# EAGLE design LAB-DEB429 (EAGLE 6.6.0)
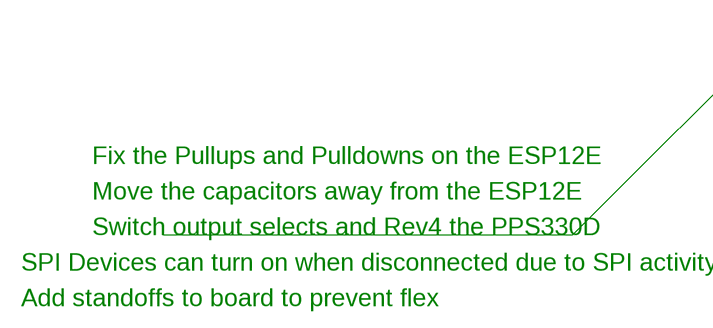
[diagram p0: schematic, sheet 1, part 1 of 2]
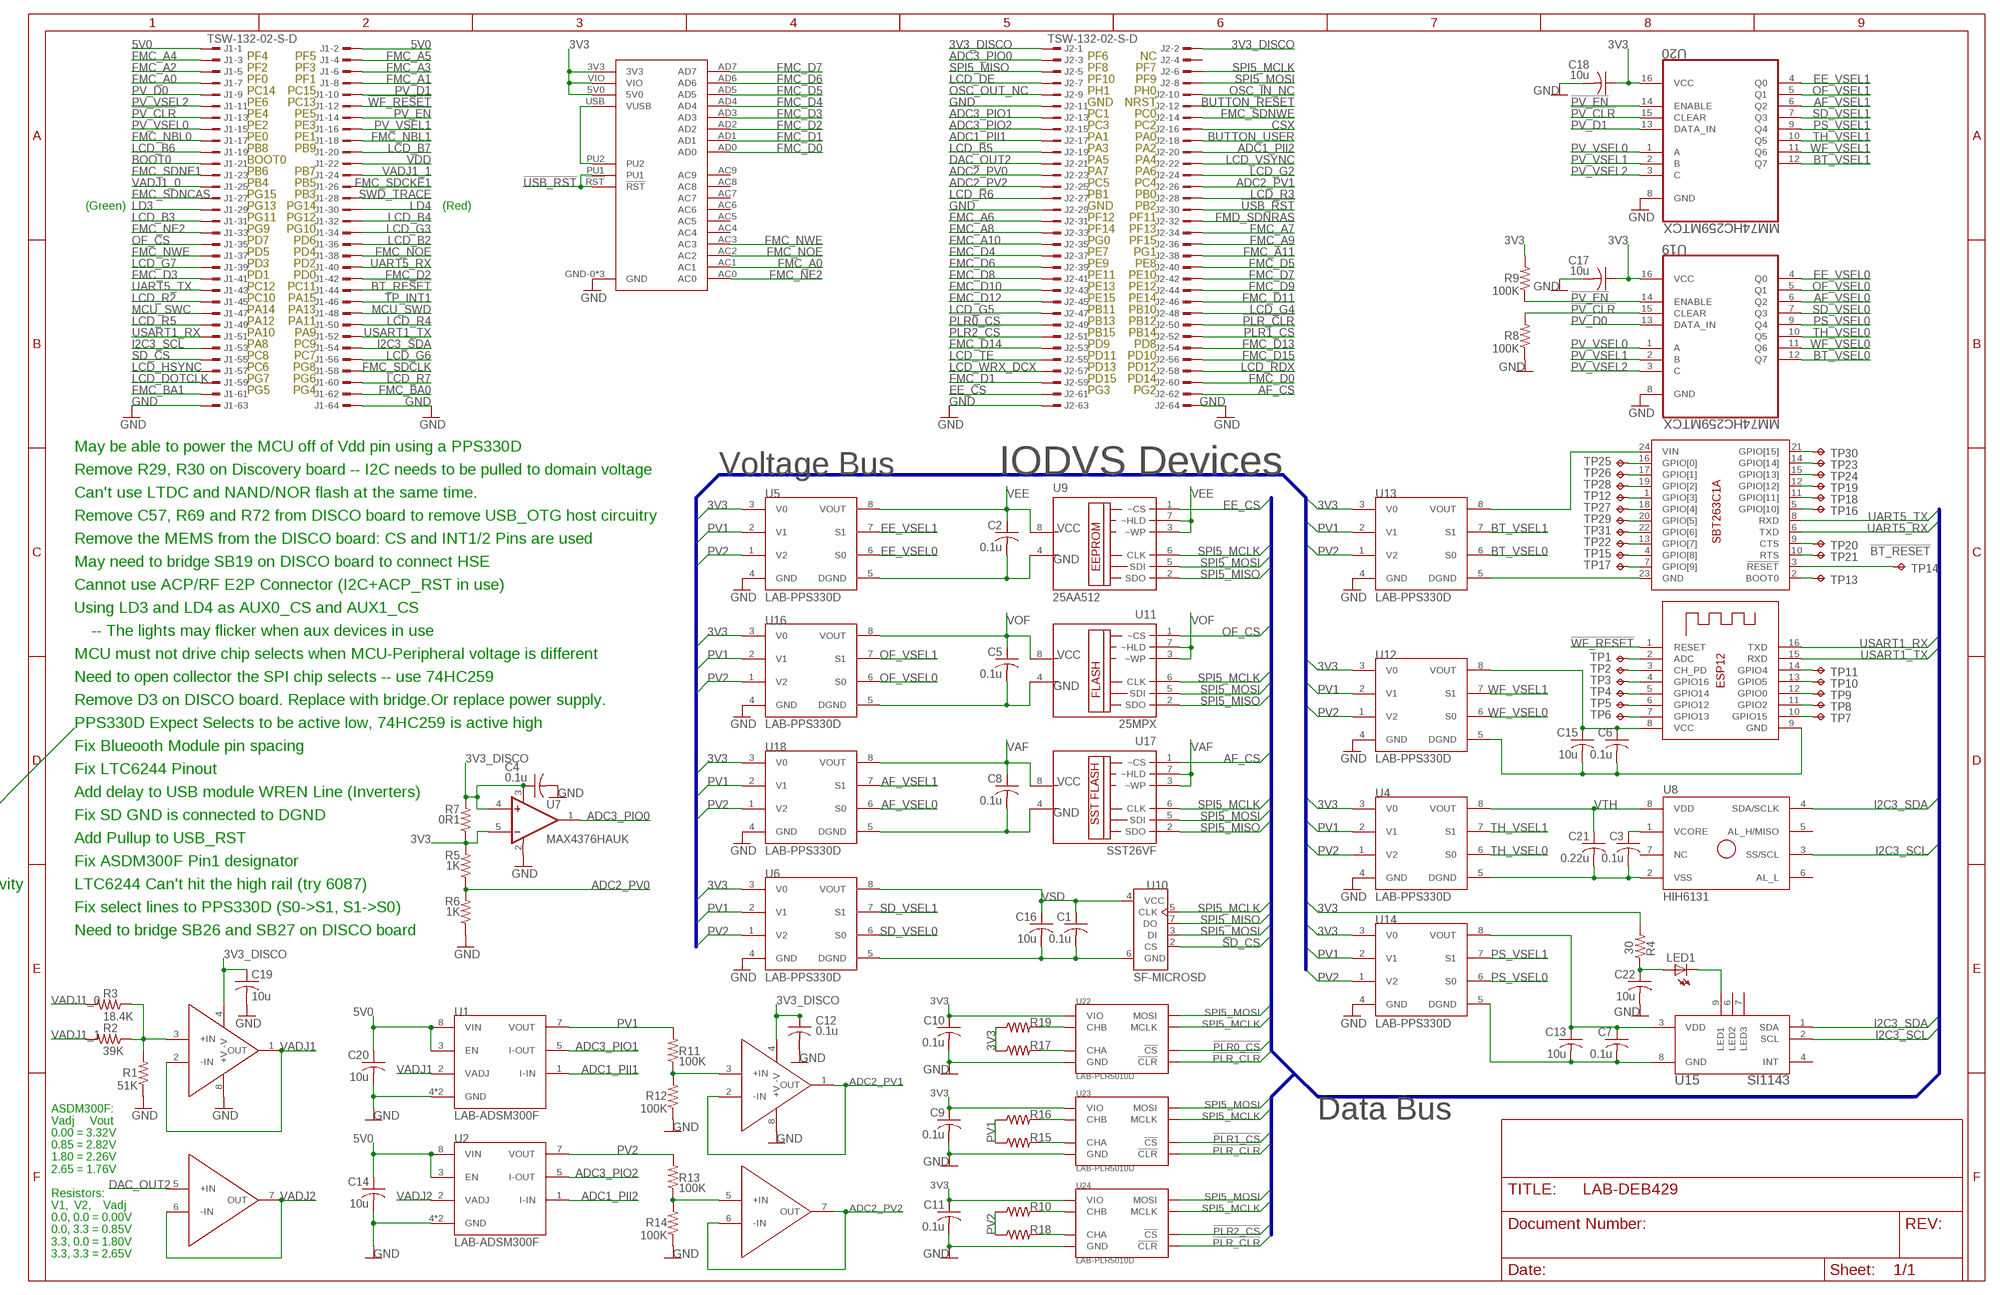
[diagram p1: schematic, sheet 1, part 2 of 2]

## Parts
C1  0.1u  C-USC0603  [C0603]
C2  0.1u  C-USC0603  [C0603]
C3  0.1u  C-USC0603  [C0603]
C4  0.1u  C-USC0603  [C0603]
C5  0.1u  C-USC0603  [C0603]
C6  0.1u  C-USC0603  [C0603]
C7  0.1u  C-USC0603  [C0603]
C8  0.1u  C-USC0603  [C0603]
C9  0.1u  C-USC0603  [C0603]
C10  0.1u  C-USC0603  [C0603]
C11  0.1u  C-USC0603  [C0603]
C12  0.1u  C-USC0603  [C0603]
C13  10u  C-USC0603  [C0603]
C14  10u  C-USC0603  [C0603]
C15  10u  C-USC0603  [C0603]
C16  10u  C-USC0603  [C0603]
C17  10u  C-USC0603  [C0603]
C18  10u  C-USC0603  [C0603]
C19  10u  C-USC0603  [C0603]
C20  10u  C-USC0603  [C0603]
C21  0.22u  C-USC0603  [C0603]
C22  10u  C-USC0603  [C0603]
J1  TSW-132-02-S-D  [TSW-132-02-S-D]
J2  TSW-132-02-S-D  [TSW-132-02-S-D]
LED1  LEDCHIPLED_1206  [CHIPLED_1206]
R1  51K  R-US_R0603  [R0603]
R2  39K  R-US_R0603  [R0603]
R3  18.4K  R-US_R0603  [R0603]
R4  30  R-US_R0603  [R0603]
R5  1K  R-US_R0603  [R0603]
R6  1K  R-US_R0603  [R0603]
R7  0R1  R-US_R0603  [R0603]
R8  100K  R-US_R0603  [R0603]
R9  100K  R-US_R0603  [R0603]
R10  R-US_0204/7  [0204/7]
R11  100K  R-US_R0603  [R0603]
R12  100K  R-US_R0603  [R0603]
R13  100K  R-US_R0603  [R0603]
R14  100K  R-US_R0603  [R0603]
R15  R-US_0204/7  [0204/7]
R16  R-US_0204/7  [0204/7]
R17  R-US_0204/7  [0204/7]
R18  R-US_0204/7  [0204/7]
R19  R-US_0204/7  [0204/7]
TP1  TPPAD1-13  [P1-13]
TP2  TPPAD1-13  [P1-13]
TP3  TPPAD1-13  [P1-13]
TP4  TPPAD1-13  [P1-13]
TP5  TPPAD1-13  [P1-13]
TP6  TPPAD1-13  [P1-13]
TP7  TPPAD1-13  [P1-13]
TP8  TPPAD1-13  [P1-13]
TP9  TPPAD1-13  [P1-13]
TP10  TPPAD1-13  [P1-13]
TP11  TPPAD1-13  [P1-13]
TP12  TPPAD1-13  [P1-13]
TP13  TPPAD1-13  [P1-13]
TP14  TPPAD1-13  [P1-13]
TP15  TPPAD1-13  [P1-13]
TP16  TPPAD1-13  [P1-13]
TP17  TPPAD1-13  [P1-13]
TP18  TPPAD1-13  [P1-13]
TP19  TPPAD1-13  [P1-13]
TP20  TPPAD1-13  [P1-13]
TP21  TPPAD1-13  [P1-13]
TP22  TPPAD1-13  [P1-13]
TP23  TPPAD1-13  [P1-13]
TP24  TPPAD1-13  [P1-13]
TP25  TPPAD1-13  [P1-13]
TP26  TPPAD1-13  [P1-13]
TP27  TPPAD1-13  [P1-13]
TP28  TPPAD1-13  [P1-13]
TP29  TPPAD1-13  [P1-13]
TP30  TPPAD1-13  [P1-13]
TP31  TPPAD1-13  [P1-13]
U1  LAB-ADSM300F  [LAB-ASDM300F]
U2  LAB-ADSM300F  [LAB-ASDM300F]
U3  LTC6244  [MSOP8]
U4  LAB-PPS330D  [LAB-PPS330D]
U5  LAB-PPS330D  [LAB-PPS330D]
U6  LAB-PPS330D  [LAB-PPS330D]
U7  MAX4376HAUK  MAX4376  [SOT23-5]
U8  HIH6131  [SO-08M]
U9  25AA512  [SO-08M]
U10  SF-MICROSD  [MICROSD]
U11  25MPX  [SO-08M]
U12  LAB-PPS330D  [LAB-PPS330D]
U13  LAB-PPS330D  [LAB-PPS330D]
U14  LAB-PPS330D  [LAB-PPS330D]
U15  SI1143  [QFN10]
U16  LAB-PPS330D  [LAB-PPS330D]
U17  SST26VF  [SO-08M]
U18  LAB-PPS330D  [LAB-PPS330D]
U19  MM74HC259MTCX  [SOP65P640X90-16N]
U20  MM74HC259MTCX  [SOP65P640X90-16N]
U21  LTC6244  [MSOP8]
U22  LAB-PLR5010D  [LAB-PLR5010D]
U23  LAB-PLR5010D  [LAB-PLR5010D]
U24  LAB-PLR5010D  [LAB-PLR5010D]
U25  ESP-12  [ESP-12]
U26  SPBT2632C1A  [SPBT2632C1A]
U27  UM232H  [UM232H]

## Nets
3V3: C9.1 C10.1 C11.1 C17.1 C18.1 R4.2 R5.2 R7.1 R9.2 R17.1 R19.1 U4.3(V0) U5.3(V0) U6.3(V0) U7.5(-IN) U12.3(V0) U13.3(V0) U14.3(V0) U16.3(V0) U18.3(V0) U19.16(VCC) U20.16(VCC) U22.VDD(VIO) U23.VDD(VIO) U24.VDD(VIO) U27.3V3 U27.5V0 U27.VIO
3V3_DISCO: C4.1 C12.1 C19.1 J2.1 J2.2 R7.2 U3.4(-V) U7.3(V+) U7.4(+IN) U21.4(-V)
5V0: C14.1 C20.1 J1.1 J1.2 U1.3(EN) U1.8(VIN) U2.3(EN) U2.8(VIN)
!BT_RESET: J1.44 TP14.TP U26.3(!RESET)
!PLR0_CS: J2.49 U22.!CLR(!CS)
!PLR1_CS: J2.52 U23.!CLR(!CS)
!PLR2_CS: J2.51 U24.!CLR(!CS)
!PLR_CLR: J2.50 U22.!CS(!CLR) U23.!CS(!CLR) U24.!CS(!CLR)
!PV_CLR: J1.13 R8.2 U19.15(CLEAR) U20.15(CLEAR)
!PV_EN: J1.14 R9.1 U19.14(ENABLE) U20.14(ENABLE)
!USB_RST: J2.30 U27.!RST U27.PU1
!WF_RESET: J1.12 U25.1(RESET)
ADC1_PII1: J2.17 U1.1(I-IN)
ADC1_PII2: J2.20 U2.1(I-IN)
ADC2_PV0: J2.23 R5.1 R6.2
ADC2_PV1: J2.26 U21.1(OUT) U21.2(-IN)
ADC2_PV2: J2.25 U21.6(-IN) U21.7(OUT)
ADC3_PIO0: J2.3 U7.1(OUT)
ADC3_PIO1: J2.13 U1.5(I-OUT)
ADC3_PIO2: J2.15 U2.5(I-OUT)
AF_CS: J2.62 U17.1(~CS)
AF_VSEL0: U18.6(S0) U19.6(Q2)
AF_VSEL1: U18.7(S1) U20.6(Q2)
BOOT0: J1.21
BT_VSEL0: U13.6(S0) U19.12(Q7)
BT_VSEL1: U13.7(S1) U20.12(Q7)
BUTTON_RESET: J2.12
BUTTON_USER: J2.18
CSX: J2.16
DAC_OUT2: J2.21 U3.5(+IN)
EE_CS: J2.61 U9.1(~CS)
EE_VSEL0: U5.6(S0) U19.4(Q0)
EE_VSEL1: U5.7(S1) U20.4(Q0)
FMC_A0: J1.7 U27.AC1
FMC_A1: J1.8
FMC_A2: J1.5
FMC_A3: J1.6
FMC_A4: J1.3
FMC_A5: J1.4
FMC_A6: J2.31
FMC_A7: J2.34
FMC_A8: J2.33
FMC_A9: J2.36
FMC_A10: J2.35
FMC_A11: J2.38
FMC_BA0: J1.62
FMC_BA1: J1.61
FMC_D0: J2.60 U27.AD0
FMC_D1: J2.59 U27.AD1
FMC_D2: J1.42 U27.AD2
FMC_D3: J1.41 U27.AD3
FMC_D4: J2.37 U27.AD4
FMC_D5: J2.40 U27.AD5
FMC_D6: J2.39 U27.AD6
FMC_D7: J2.42 U27.AD7
FMC_D8: J2.41
FMC_D9: J2.44
FMC_D10: J2.43
FMC_D11: J2.46
FMC_D12: J2.45
FMC_D13: J2.54
FMC_D14: J2.53
FMC_D15: J2.56
FMC_NBL0: J1.17
FMC_NBL1: J1.18
FMC_NE2: J1.33 U27.AC0
FMC_NOE: J1.38 U27.AC2
FMC_NWE: J1.37 U27.AC3
FMC_SDCKE1: J1.26
FMC_SDCLK: J1.58
FMC_SDNCAS: J1.27
FMC_SDNE1: J1.23
FMC_SDNWE: J2.14
FMD_SDNRAS: J2.32
GND: C1.2 C4.2 C9.2 C10.2 C11.2 C12.2 C14.2 C16.2 C17.2 C18.2 C19.2 C20.2 C22.2 J1.63 J1.64 J2.11 J2.29 J2.63 J2.64 R1.1 R6.1 R8.1 R12.1 R14.1 U1.4(GND) U1.6(GND) U2.4(GND) U2.6(GND) U3.8(+V) U4.4(GND) U5.4(GND) U6.4(GND) U6.5(DGND) U7.2(V-) U10.6(GND) U12.4(GND) U13.4(GND) U14.4(GND) U16.4(GND) U18.4(GND) U19.8(GND) U20.8(GND) U21.8(+V) U22.CHA(GND) U23.CHA(GND) U24.CHA(GND) U27.GND-0(GND) U27.GND-1(GND) U27.SLD(GND)
I2C3_SCL: J1.53 U8.3(SS/SCL) U15.2(SCL)
I2C3_SDA: J1.54 U8.4(SDA/SCLK) U15.1(SDA)
LCD_B2: J1.36
LCD_B3: J1.31
LCD_B4: J1.32
LCD_B5: J2.19
LCD_B6: J1.19
LCD_B7: J1.20
LCD_DE: J2.7
LCD_DOTCLK: J1.59
LCD_G2: J2.24
LCD_G3: J1.34
LCD_G4: J2.48
LCD_G5: J2.47
LCD_G6: J1.56
LCD_G7: J1.39
LCD_HSYNC: J1.57
LCD_R2: J1.45
LCD_R3: J2.28
LCD_R4: J1.50
LCD_R5: J1.49
LCD_R6: J2.27
LCD_R7: J1.60
LCD_RDX: J2.58
LCD_TE: J2.55
LCD_VSYNC: J2.22
LCD_WRX_DCX: J2.57
LD3: J1.29
LD4: J1.30
MCU_SWC: J1.47
MCU_SWD: J1.48
N$1: C6.1 C15.1 U12.8(VOUT) U25.8(VCC)
N$2: C2.2 U5.5(DGND) U9.4(GND)
N$3: C22.1 LED1.A R4.1
N$4: TP12.TP U26.1(GPIO[3])
N$5: U13.5(DGND) U26.23(GND)
N$6: TP10.TP U25.13(GPIO5)
N$7: TP7.TP U25.10(GPIO15)
N$8: TP13.TP U26.2(BOOT0)
N$9: TP8.TP U25.11(GPIO2)
N$10: TP9.TP U25.12(GPIO0)
N$11: TP11.TP U25.14(GPIO4)
N$12: TP1.TP U25.2(ADC)
N$13: TP2.TP U25.3(CH_PD)
N$14: TP3.TP U25.4(GPIO16)
N$15: TP4.TP U25.5(GPIO14)
N$16: TP5.TP U25.6(GPIO12)
N$17: TP6.TP U25.7(GPIO13)
N$18: TP15.TP U26.4(GPIO[8])
N$19: TP16.TP U26.5(GPIO[10])
N$20: LED1.C U15.9(LED1)
N$21: TP17.TP U26.7(GPIO[9])
N$22: C6.2 C15.2 U12.5(DGND) U25.9(GND)
N$23: TP18.TP U26.11(GPIO[11])
N$24: C5.2 U11.4(GND) U16.5(DGND)
N$25: U27.PU2 U27.USB(VUSB)
N$26: U13.8(VOUT) U26.24(VIN)
N$27: C3.1 U8.1(VCORE)
N$28: TP19.TP U26.12(GPIO[12])
N$29: TP22.TP U26.13(GPIO[7])
N$30: TP23.TP U26.14(GPIO[14])
N$31: C8.2 U17.4(GND) U18.5(DGND)
N$32: TP24.TP U26.15(GPIO[13])
N$33: TP25.TP U26.16(GPIO[0])
N$34: TP26.TP U26.17(GPIO[1])
N$35: TP27.TP U26.18(GPIO[4])
N$36: TP28.TP U26.19(GPIO[2])
N$37: TP29.TP U26.20(GPIO[5])
N$38: C7.2 C13.2 U14.5(DGND) U15.8(GND)
N$39: C3.2 C21.2 U4.5(DGND) U8.2(VSS)
N$40: C7.1 C13.1 U14.8(VOUT) U15.3(VDD)
N$41: TP30.TP U26.21(GPIO[15])
N$42: TP31.TP U26.22(GPIO[6])
N$51: TP20.TP U26.9(CTS)
N$52: TP21.TP U26.10(RTS)
N$176: R17.2 U22.CHB(CHA)
N$177: R19.2 U22.MCLK(CHB)
N$178: R16.2 U23.MCLK(CHB)
N$179: R15.2 U23.CHB(CHA)
N$180: R10.2 U24.MCLK(CHB)
N$181: R18.2 U24.CHB(CHA)
N$182: R13.1 R14.2 U21.5(+IN)
N$183: R11.1 R12.2 U21.3(+IN)
OF_CS: J1.35 U11.1(~CS)
OF_VSEL0: U16.6(S0) U19.5(Q1)
OF_VSEL1: U16.7(S1) U20.5(Q1)
OSC_IN_NC: J2.10
OSC_OUT_NC: J2.9
PS_VSEL0: U14.6(S0) U19.9(Q4)
PS_VSEL1: U14.7(S1) U20.9(Q4)
PV1: R11.2 R15.1 R16.1 U1.7(VOUT) U4.2(V1) U5.2(V1) U6.2(V1) U12.2(V1) U13.2(V1) U14.2(V1) U16.2(V1) U18.2(V1)
PV2: R10.1 R13.2 R18.1 U2.7(VOUT) U4.1(V2) U5.1(V2) U6.1(V2) U12.1(V2) U13.1(V2) U14.1(V2) U16.1(V2) U18.1(V2)
PV_D0: J1.9 U19.13(DATA_IN)
PV_D1: J1.10 U20.13(DATA_IN)
PV_VSEL0: J1.15 U19.1(A) U20.1(A)
PV_VSEL1: J1.16 U19.2(B) U20.2(B)
PV_VSEL2: J1.11 U19.3(C) U20.3(C)
SD_CS: J1.55 U10.2(CS)
SD_VSEL0: U6.6(S0) U19.7(Q3)
SD_VSEL1: U6.7(S1) U20.7(Q3)
SPI5_MCLK: J2.6 U9.6(CLK) U10.5(CLK) U11.6(CLK) U17.6(CLK) U22.GND(MCLK) U23.GND(MCLK) U24.GND(MCLK)
SPI5_MISO: J2.5 U9.2(SDO) U10.7(DO) U11.2(SDO) U17.2(SDO)
SPI5_MOSI: J2.8 U9.5(SDI) U10.3(DI) U11.5(SDI) U17.5(SDI) U22.MOSI U23.MOSI U24.MOSI
SWD_TRACE: J1.28
TH_VSEL0: U4.6(S0) U19.10(Q5)
TH_VSEL1: U4.7(S1) U20.10(Q5)
TP_INT1: J1.46
UART5_RX: J1.40 U26.6(TXD)
UART5_TX: J1.43 U26.8(RXD)
USART1_RX: J1.51 U25.16(TXD)
USART1_TX: J1.52 U25.15(RXD)
VADJ1: U1.2(VADJ) U3.1(OUT) U3.2(-IN)
VADJ1_0: J1.25 R3.2
VADJ1_1: J1.24 R2.2
VADJ2: U2.2(VADJ) U3.6(-IN) U3.7(OUT)
VADJIN: R1.2 R2.1 R3.1 U3.3(+IN)
VAF: C8.1 U17.3(~WP) U17.7(~HLD) U17.8(VCC) U18.8(VOUT)
VDD: J1.22
VEE: C2.1 U5.8(VOUT) U9.3(~WP) U9.7(~HLD) U9.8(VCC)
VOF: C5.1 U11.3(~WP) U11.7(~HLD) U11.8(VCC) U16.8(VOUT)
VSD: C1.1 C16.1 U6.8(VOUT) U10.4(VCC)
VTH: C21.1 U4.8(VOUT) U8.8(VDD)
WF_VSEL0: U12.6(S0) U19.11(Q6)
WF_VSEL1: U12.7(S1) U20.11(Q6)
Unconnected: J2.4 U8.5(AL_H/MISO) U8.6(AL_L) U8.7(NC) U15.4(INT) U15.6(LED2) U15.7(LED3) U27.AC4 U27.AC5 U27.AC6 U27.AC7 U27.AC8 U27.AC9

## Buses
SPI5_MCLK,SPI5_MOSI,SPI5_MISO,EE_CS,OF_CS,AF_CS,SD_CS,!PLR0_CS,!PLR1_CS,!PLR2_CS,I2C3_SDA,I2C3_SCL,USART1_TX,USART1_RX,UART5_TX,UART5_RX,!PLR_CLR
+3.3V,PV1,PV2

## Notes on the sheet
- PF4 | PF5 | PF6 | NC
- PF2 | PF3 | PF8 | PF7
- PF0 | PF1 | PF10 | PF9
- PC14 | PC15 | PH1 | PH0
- PE6 | PC13 | GND | NRST
- PE4 | PE5 | PC1 | PC0
- PE2 | PE3 | PC3 | PC2
- PE0 | PE1 | PA1 | PA0
- PB8 | PB9 | PA3 | PA2
- BOOT0 | PA5 | PA4
- PB6 | PB7 | PA7 | PA6
- PB4 | PB5 | PC5 | PC4
- PG15 | PB3 | PB1 | PB0
- (Green) | PG13 | PG14 | (Red) | GND | PB2
- PG11 | PG12 | PF12 | PF11
- PG9 | PG10 | PF14 | PF13
- PD7 | PD6 | PG0 | PF15
- PD5 | PD4 | PE7 | PG1
- PD3 | PD2 | PE9 | PE8
- PD1 | PD0 | PE11 | PE10
- PC12 | PC11 | PE13 | PE12
- PC10 | PA15 | PE15 | PE14
- PA14 | PA13 | PB11 | PB10
- PA12 | PA11 | PB13 | PB12
- PA10 | PA9 | PB15 | PB14
- PA8 | PC9 | PD9 | PD8
- PC8 | PC7 | PD11 | PD10
- PC6 | PG8 | PD13 | PD12
- PG7 | PG6 | PD15 | PD14
- PG5 | PG4 | PG3 | PG2
- May be able to power the MCU off of Vdd pin using a PPS330D
- Remove R29, R30 on Discovery board -- I2C needs to be pulled to domain voltage | Voltage Bus | IODVS Devices
- Can't use LTDC and NAND/NOR flash at the same time.
- Remove C57, R69 and R72 from DISCO board to remove USB_OTG host circuitry
- Remove the MEMS from the DISCO board: CS and INT1/2 Pins are used
- May need to bridge SB19 on DISCO board to connect HSE
- Cannot use ACP/RF E2P Connector (I2C+ACP_RST in use)
- Using LD3 and LD4 as AUX0_CS and AUX1_CS
- -- The lights may flicker when aux devices in use
- MCU must not drive chip selects when MCU-Peripheral voltage is different
- Need to open collector the SPI chip selects -- use 74HC259
- Remove D3 on DISCO board. Replace with bridge.Or replace power supply.
- PPS330D Expect Selects to be active low, 74HC259 is active high
- Fix Blueooth Module pin spacing
- Fix LTC6244 Pinout
- Add delay to USB module WREN Line (Inverters)
- Fix the Pullups and Pulldowns on the ESP12E | Fix SD GND is connected to DGND
- Move the capacitors away from the ESP12E | Add Pullup to USB_RST
- Switch output selects and Rev4 the PPS330D | Fix ASDM300F Pin1 designator
- SPI Devices can turn on when disconnected due to SPI activity | LTC6244 Can't hit the high rail (try 6087)
- Add standoffs to board to prevent flex | Fix select lines to PPS330D (S0->S1, S1->S0)
- Need to bridge SB26 and SB27 on DISCO board
- Data Bus
- ASDM300F:
  Vadj     Vout
  0.00 = 3.32V
  0.85 = 2.82V
  1.80 = 2.26V
  2.65 = 1.76V
  
  Resistors:
  V1,  V2,    Vadj
  0.0, 0.0 = 0.00V
  0.0, 3.3 = 0.85V
  3.3, 0.0 = 1.80V
  3.3, 3.3 = 2.65V

## Library data of the parts
C1-C22 = rcl:C-US: CAPACITOR, American symbol
J1 J2 = con-samtec:TSW-132-02-S-D: THROUGH-HOLE .025" SQ POST HEADER Source: Samtec TSW.pdf; OC_FARNELL: unknown; OC_NEWARK: unknown
LED1 = adafruit:LED: LED OSRAM: - CHIPLED LG R971, LG N971, LY N971, LG Q971, LY Q971, LO R971, LY R971 LH N974, LH R974 LS Q976, LO Q976, LY Q976 LO Q996 - Hyper CHIPLED LW Q18S LB Q993, LB Q99A, LB R99A - SideLED LS A670, LO A670, LY A670, LG A670, LP A670 LB A673, LV A673, LT A673, LW A673 LH A674 LY A675 LS A676, LA A676, LO A676, LY A676, LW A676 LS A679, LY A679, LG A679 - Hyper Micro SIDELED® LS Y876, LA Y876, LO Y876, LY Y876 LT Y87S - SmartLED LW L88C, LW L88S LB L89C, LB L89S, LG L890 LS L89K, LO L89K, LY L89K LS L896, LA L896, LO L896, LY L896 - TOPLED LS T670, LO T670, LY T670, LG T670, LP T670 LSG T670, LSP T670, LSY T670, LOP T670, LYG T670 LG T671, LOG T671, LSG T671 LB T673, LV T673, LT T673, LW T673 LH T674 LS T676, LA T676, LO T676, LY T676, LB T676, LH T676, LSB T676, LW T676 LB T67C, LV T67C, LT T67C, LS T67K, LO T67K, LY T67K, LW E67C LS E67B, LA E67B, LO E67B, LY E67B, LB E67C, LV E67C, LT E67C LW T67C LS T679, LY T679, LG T679 LS T770, LO T770, LY T770, LG T770, LP T770 LB T773, LV T773, LT T773, LW T773 LH T774 LS E675, LA E675, LY E675, LS T675 LS T776, LA T776, LO T776, LY T776, LB T776 LHGB T686 LT T68C, LB T68C - Hyper Mini TOPLED® LB M676 - Mini TOPLED Santana® LG M470 LS M47K, LO M47K, LY M47K Source: http://www.osram.convergy.de/
R1-R19 = rcl:R-US_: RESISTOR, American symbol
TP1-TP31 = testpad:TP: Test pad
U1 U2 = LAB304:LAB-ADSM300F
U3 U21 = SparkFun-AnalogIC:LTC6244: Low-noise, high-speed rail-to-rail CMOS op-amp
U4-U6 U12-U14 U16 U18 = LAB304:LAB-PPS330D
U7 = PEGMA:MAX4376
U8 = PEGMA:HIH6131
U9 = PEGMA:25AA512
U10 = PEGMA:SF-MICROSD
U11 = PEGMA:25MPX
U15 = My Library-adm:SI1143
U17 = LAB304:SST26VF
U19 U20 = Fairchild_By_element14_Batch_1:MM74HC259MTCX: 8-Bit Addressable Latch/3-to-8 Line Decoder; MPN: MM74HC259MTCX; OC_FARNELL: 1607831; OC_NEWARK: 58K1947; PACKAGE: TSSOP-16; SUPPLIER: FAIRCHILD SEMICONDUCTOR
U22-U24 = LAB304:LAB-PLR5010D
U25 = adafruit:ESP-12
U26 = LAB304:SPBT2632C1A
U27 = LAB304:UM232H

## Board
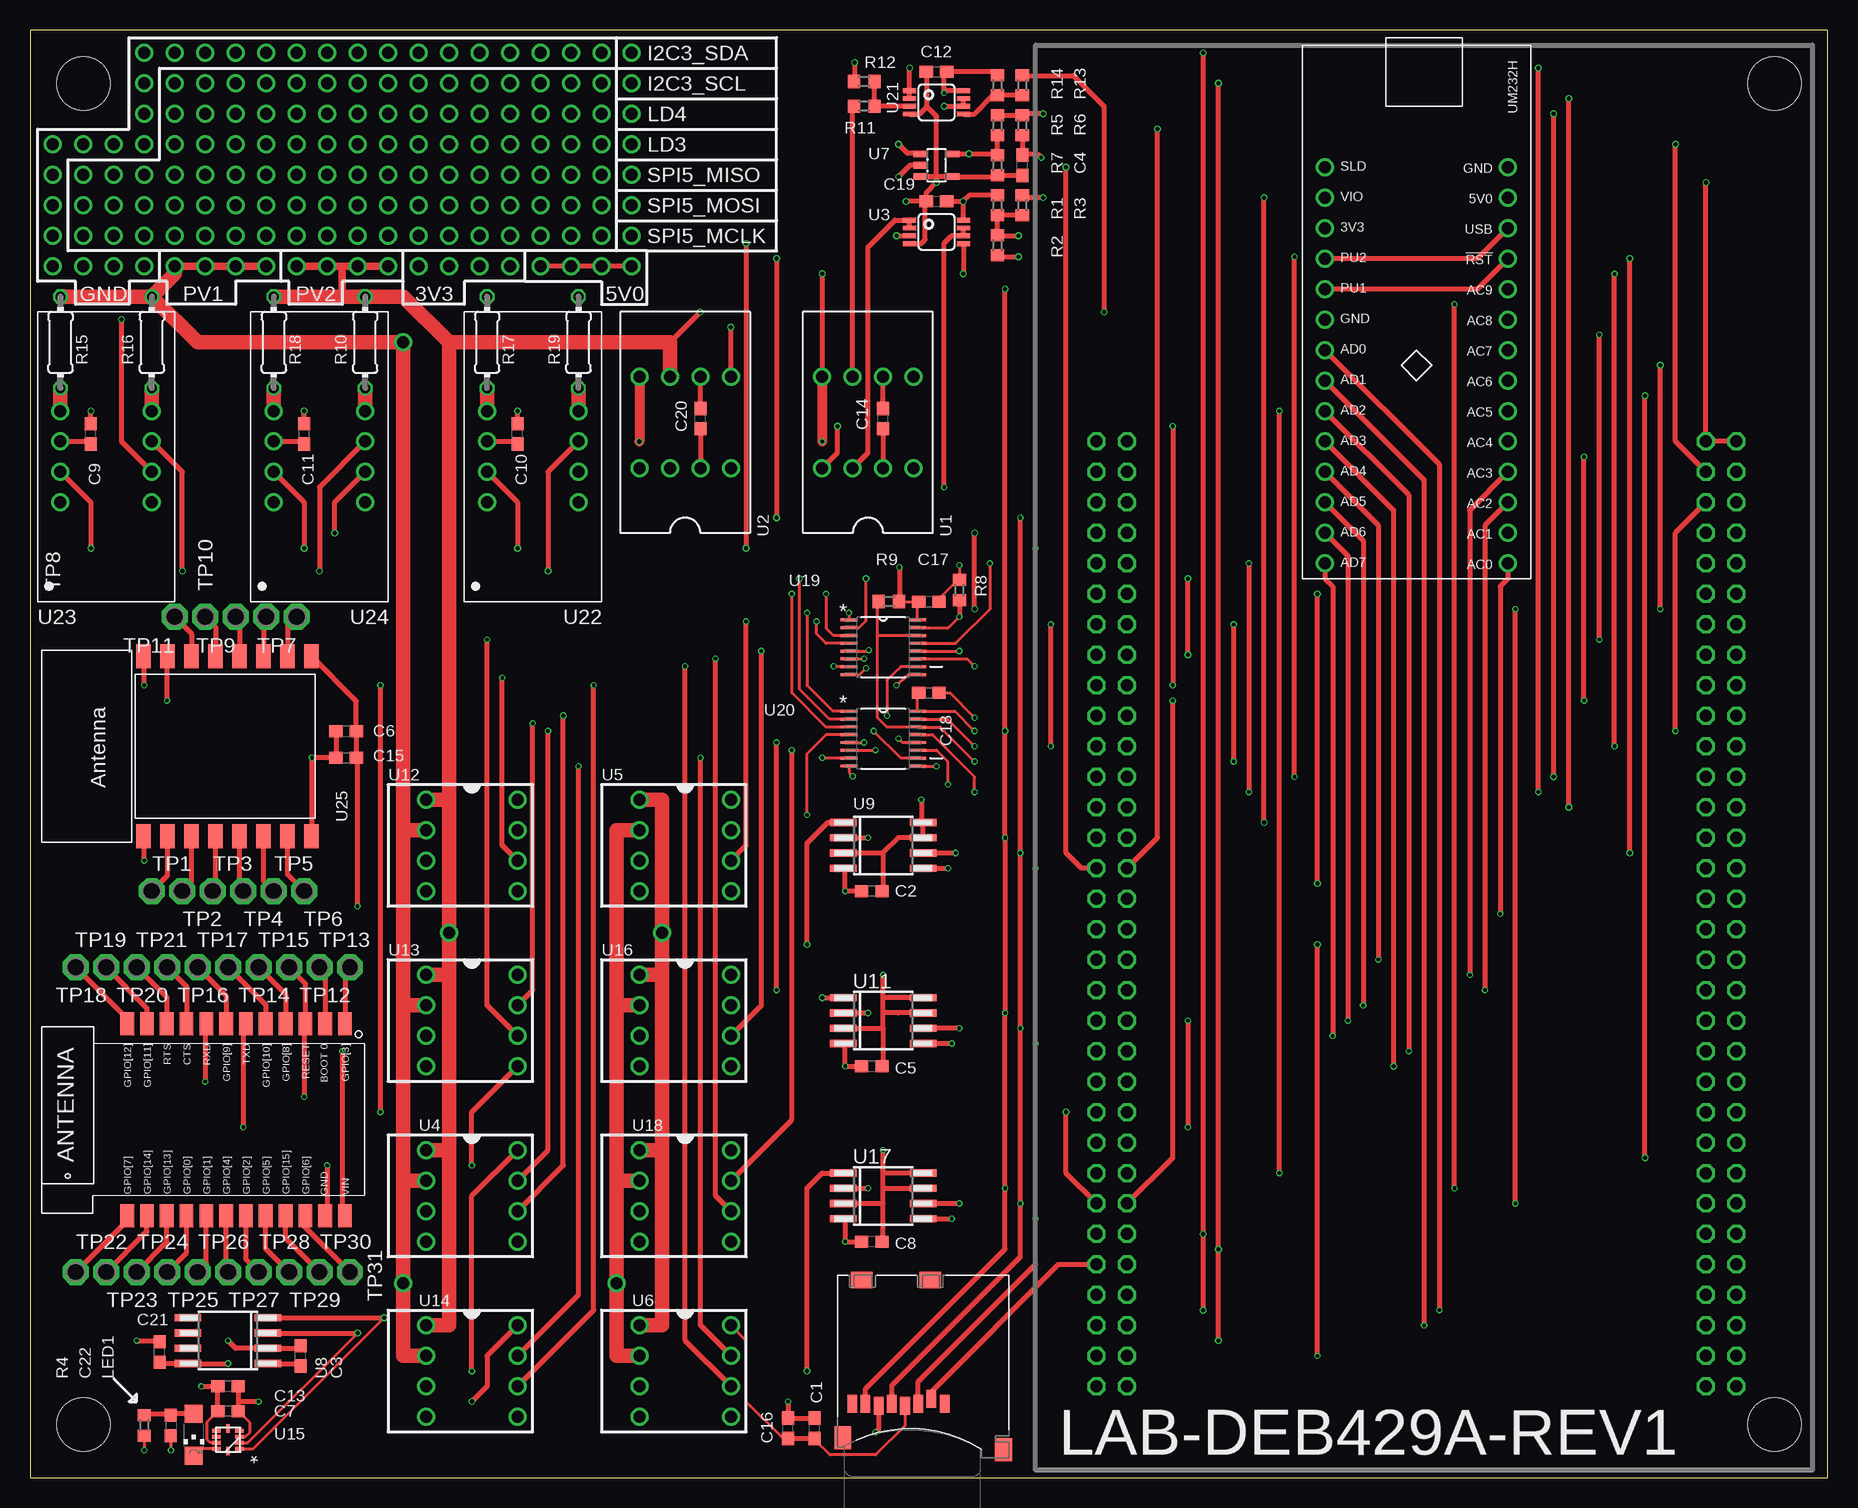
[diagram p2: board, top side]
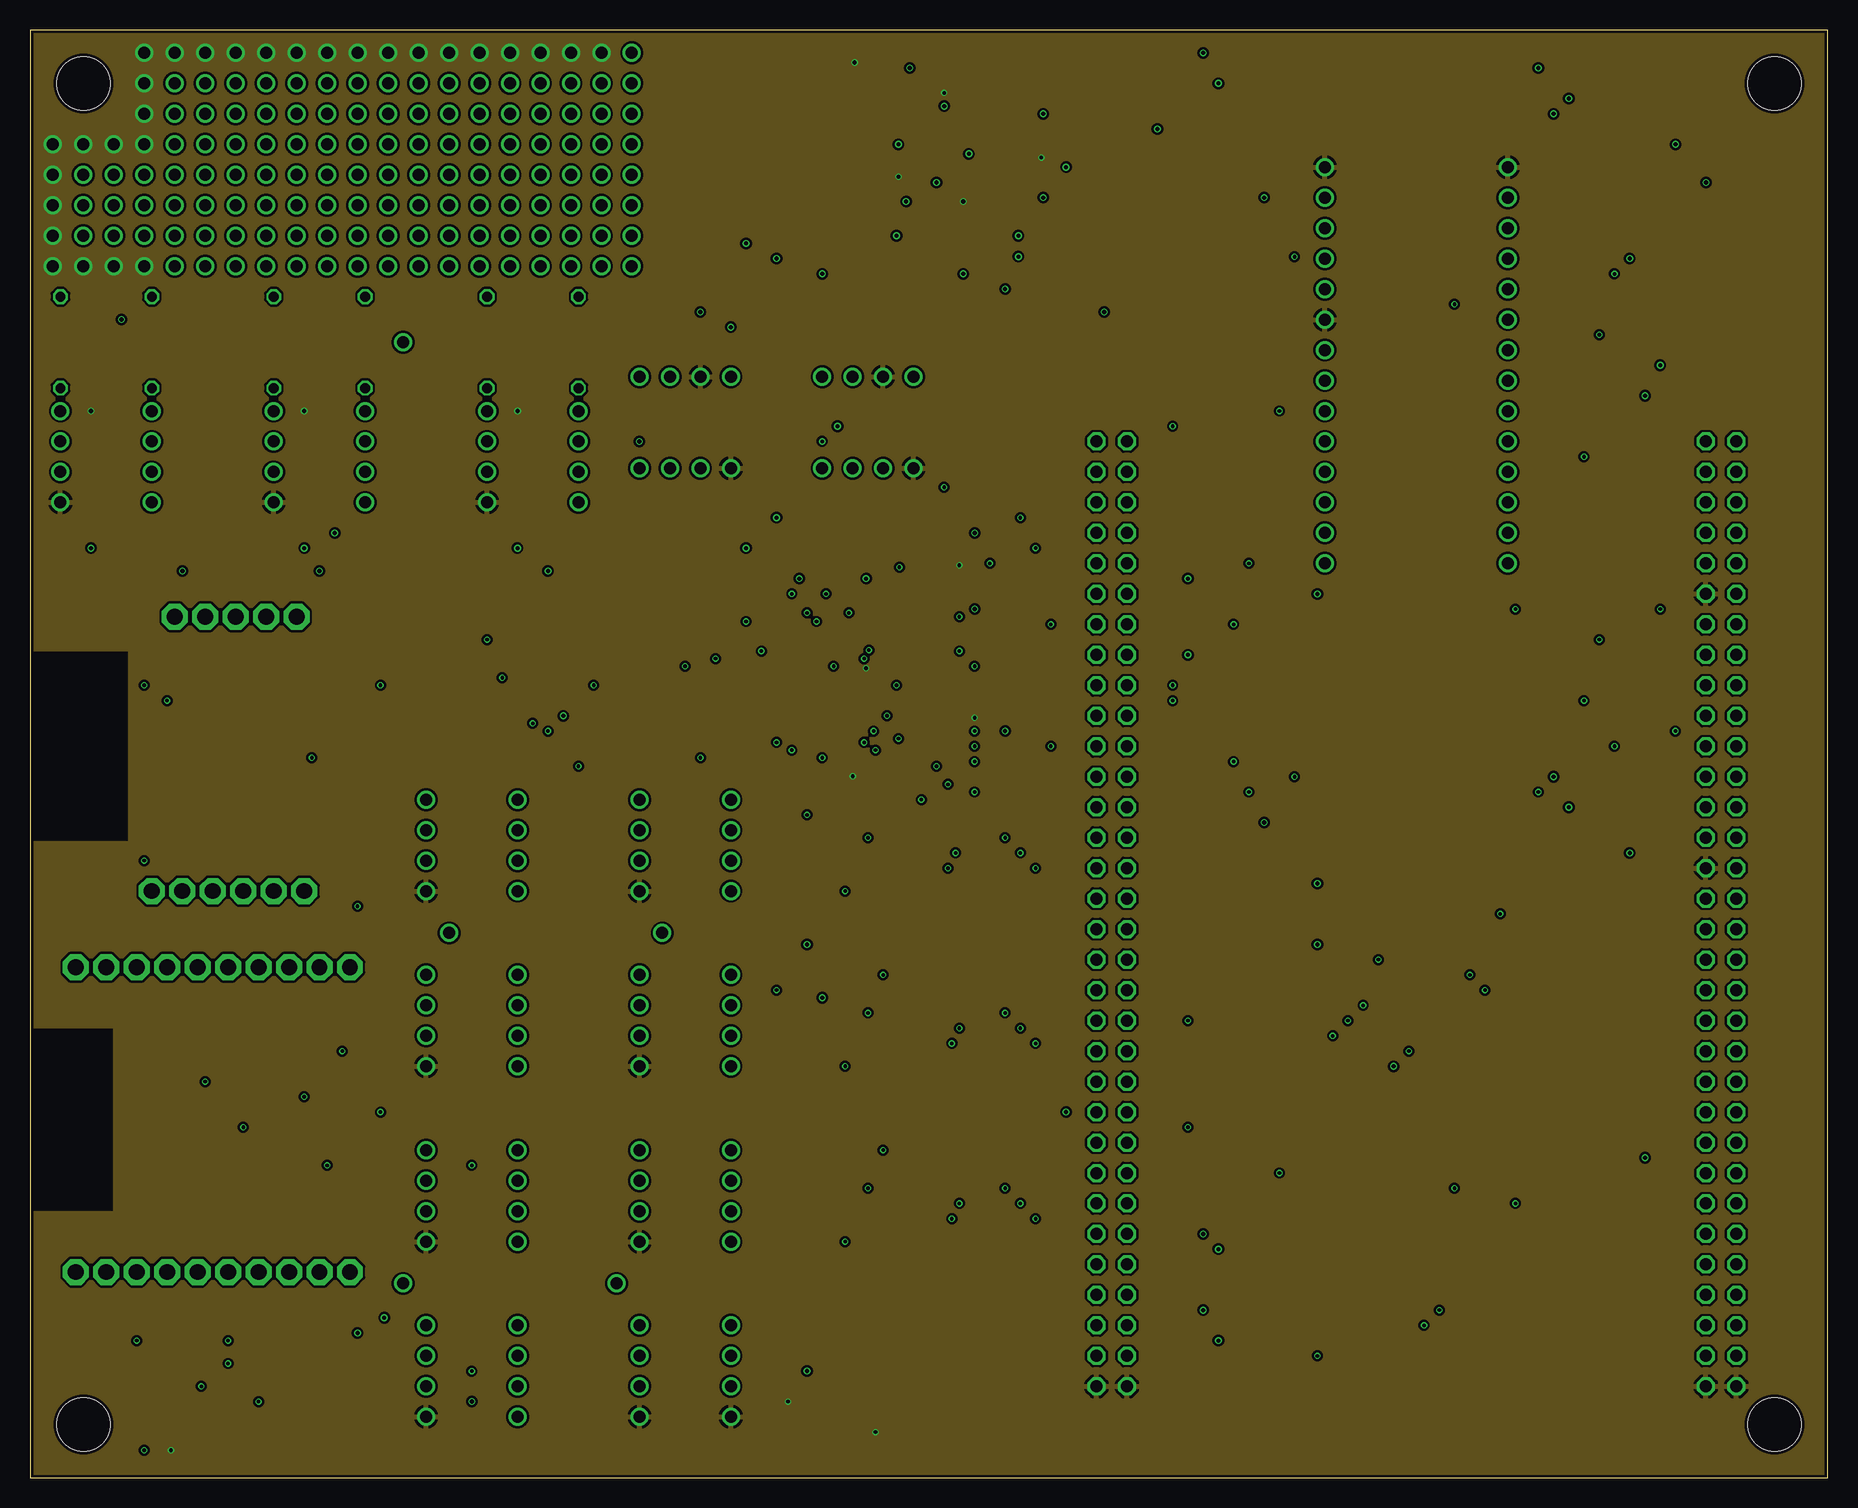
[diagram p3: board, inner layer Route2]
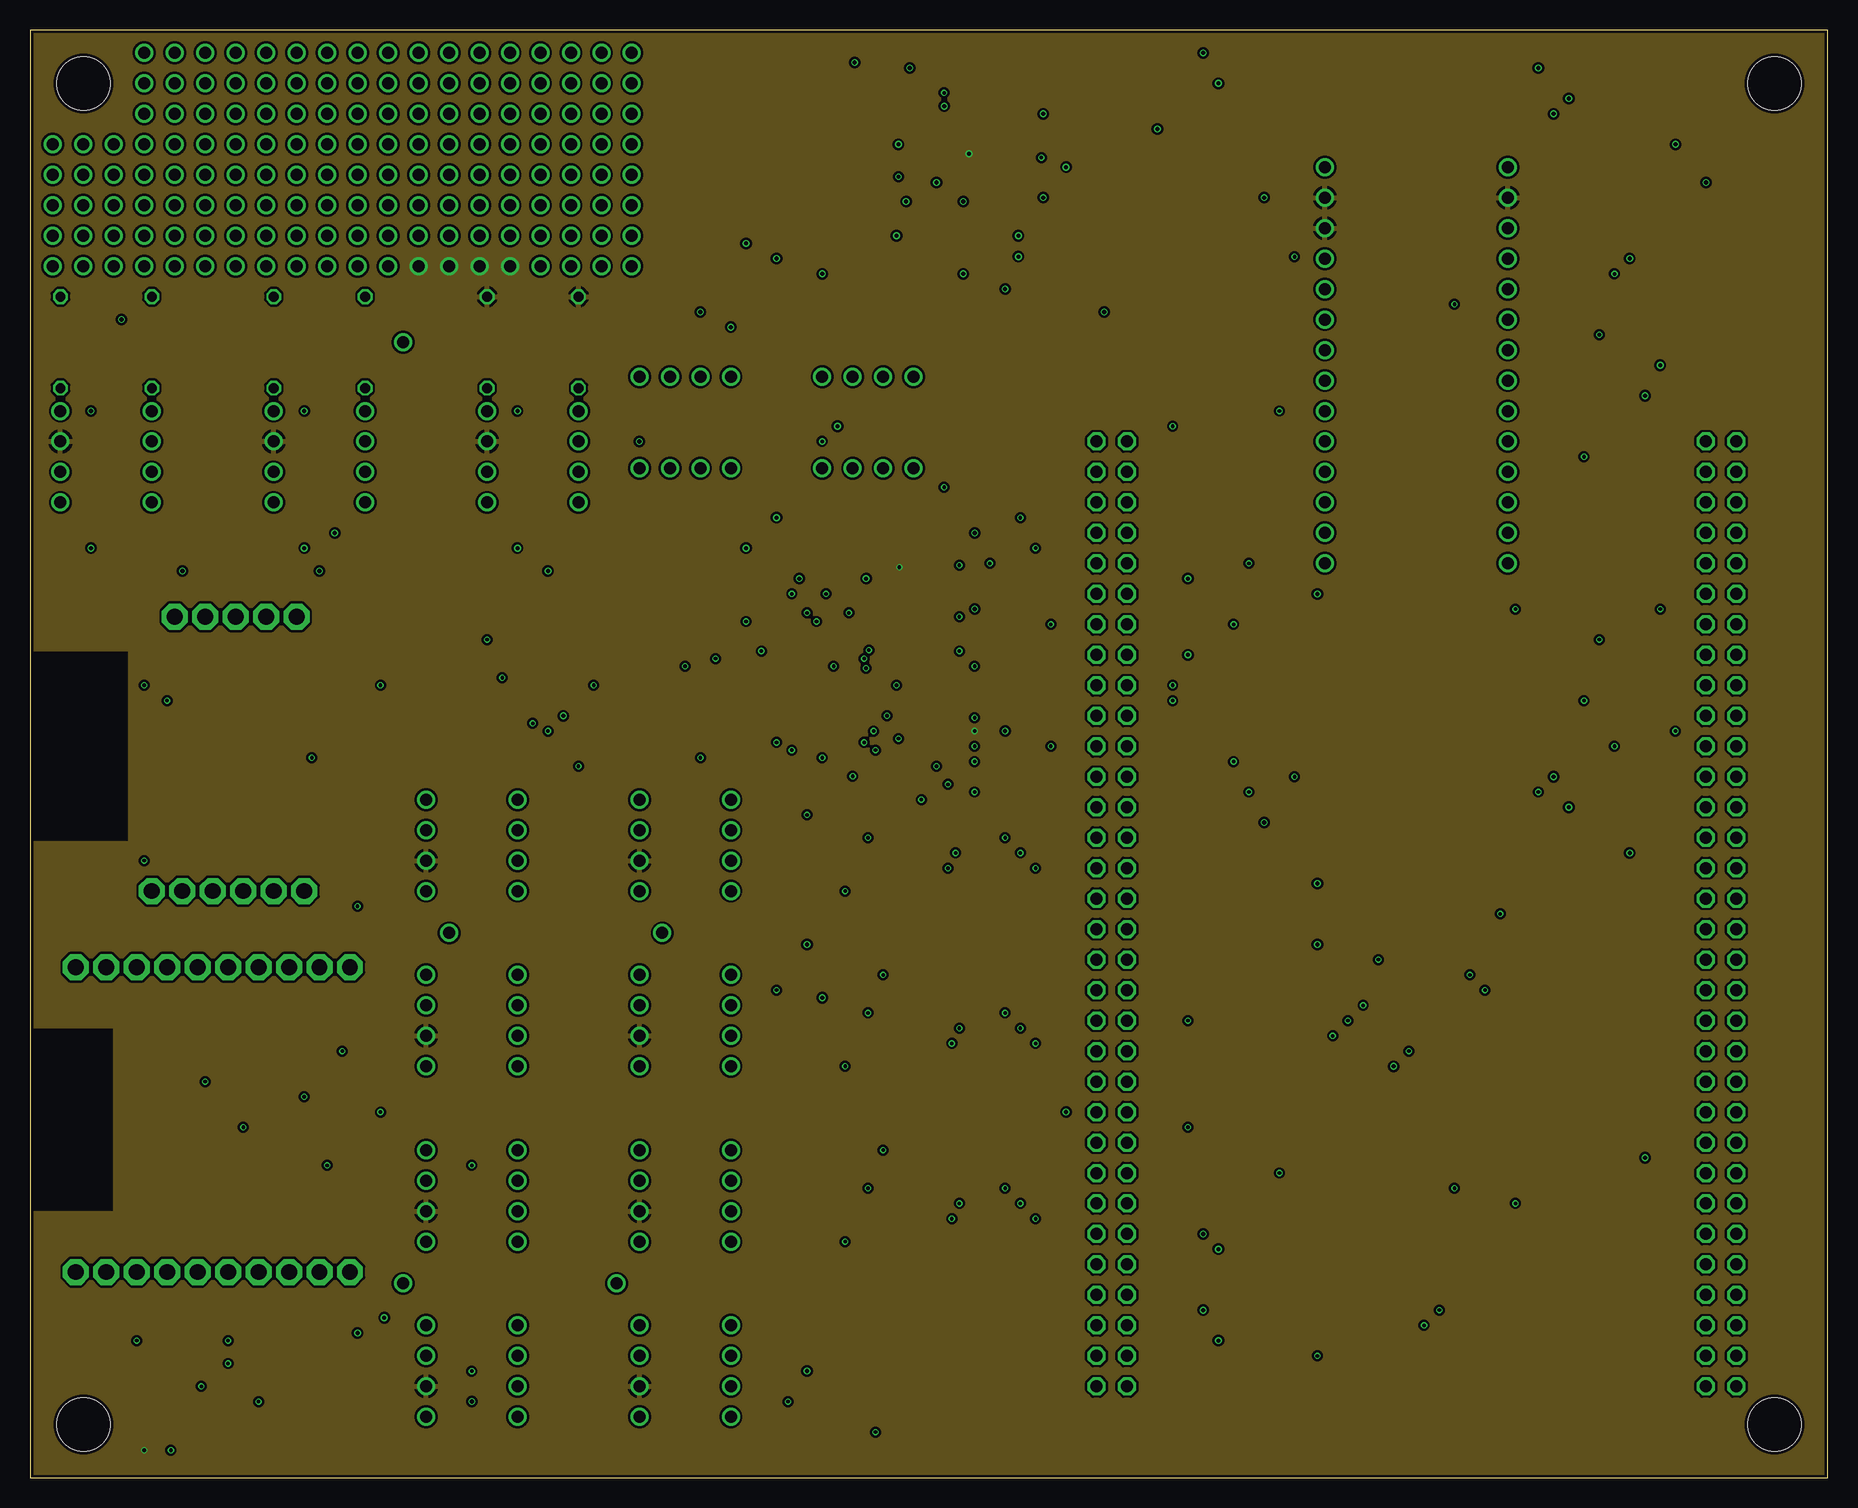
[diagram p4: board, inner layer Route15]
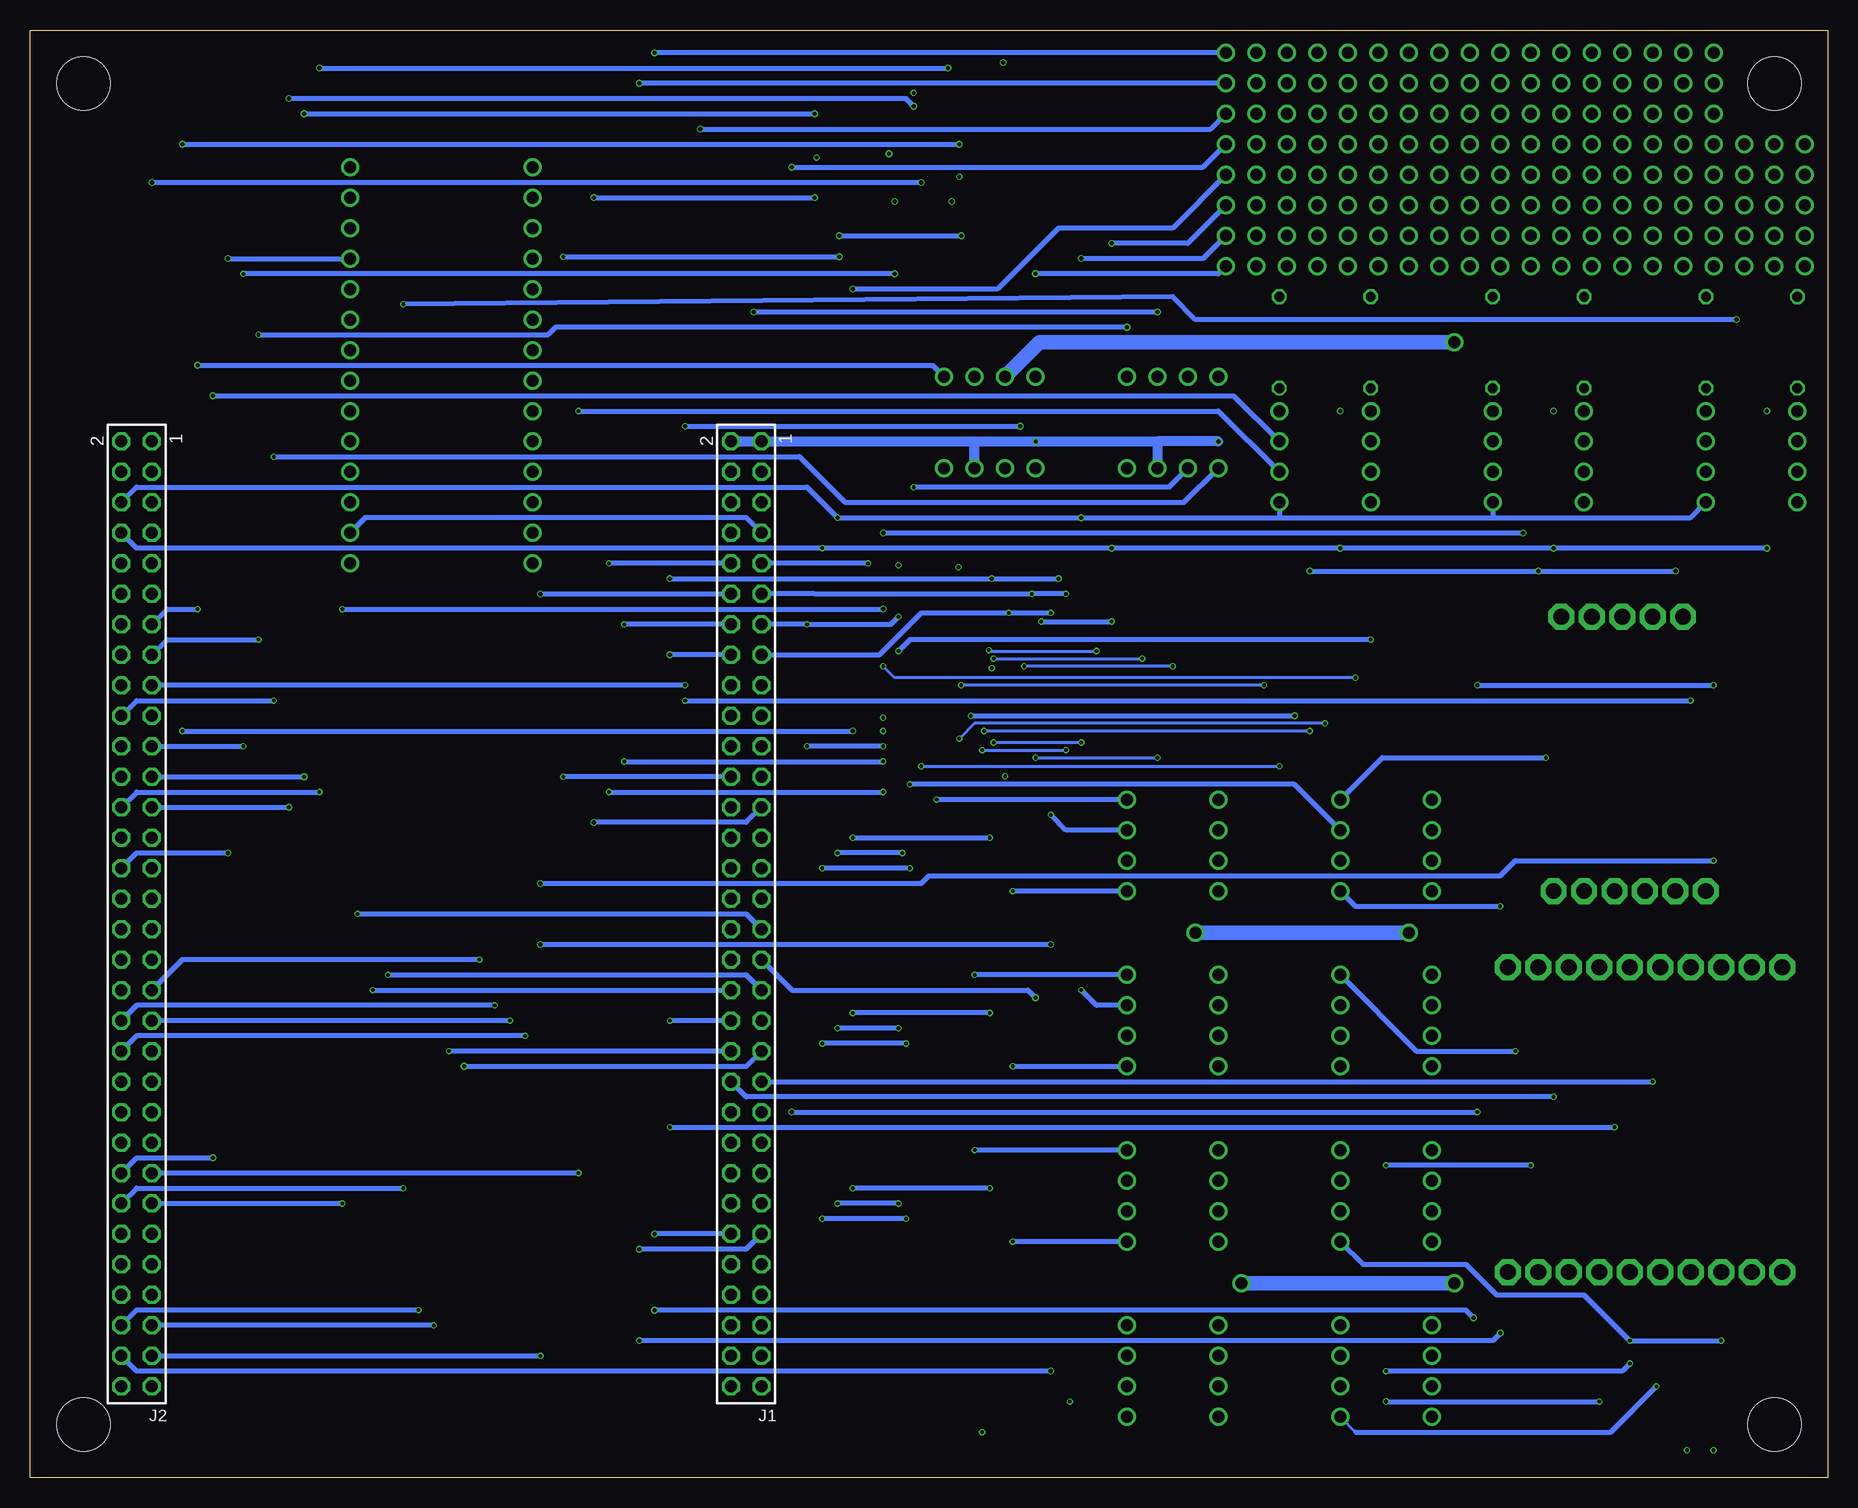
[diagram p5: board, bottom side, seen from below]

Size 149.86 x 120.65 mm. Coordinates in mm from the lower left corner, seen from the top.
Outline: 0,0 149.86,0 149.86,120.65 0,120.65 0,0
Copper layers (1*2*15*16): Top 0.035mm / dielectric 0.2mm / Route2 0.0175mm / dielectric 0.3mm / Route15 0.0175mm / dielectric 0.2mm / Bottom 0.035mm
Design rules "SeeedStudio_4layer_DRU_no_angle_20140221": minimum track width 8mil, minimum drill 12mil, track to track 8mil, track to pad 8mil, pad to pad 8mil, via to via 8mil, smd to smd 0mil, copper to edge 10mil, drill to drill 8mil, minimum pad ring 6mil, minimum via ring 4mil, stop-mask expansion 4mil, vias tented up to drill 25mil, thermal gap 10mil
Holes 4.45 mm at 4.45,4.45 145.41,4.45 145.41,116.2 4.45,116.2

### Footprints (pad centres in the part's own frame; a part is rotated, then mirrored left to right if it is on the bottom)
C0603 = smd 1.1 x 1: 1 -0.85,0; 2 0.85,0
TSW-132-02-S-D = drill 1 pad 1.5 octagon: 1 39.37,-1.27; 2 39.37,1.27; 3 36.83,-1.27; 4 36.83,1.27; 5 34.29,-1.27; 6 34.29,1.27; 7 31.75,-1.27; 8 31.75,1.27; 9 29.21,-1.27; 10 29.21,1.27; 11 26.67,-1.27; 12 26.67,1.27; 13 24.13,-1.27; 14 24.13,1.27; 15 21.59,-1.27; 16 21.59,1.27; 17 19.05,-1.27; 18 19.05,1.27; 19 16.51,-1.27; 20 16.51,1.27; 21 13.97,-1.27; 22 13.97,1.27; 23 11.43,-1.27; 24 11.43,1.27; 25 8.89,-1.27; 26 8.89,1.27; 27 6.35,-1.27; 28 6.35,1.27; 29 3.81,-1.27; 30 3.81,1.27; 31 1.27,-1.27; 32 1.27,1.27; 33 -1.27,-1.27; 34 -1.27,1.27; 35 -3.81,-1.27; 36 -3.81,1.27; 37 -6.35,-1.27; 38 -6.35,1.27; 39 -8.89,-1.27; 40 -8.89,1.27; 41 -11.43,-1.27; 42 -11.43,1.27; 43 -13.97,-1.27; 44 -13.97,1.27; 45 -16.51,-1.27; 46 -16.51,1.27; 47 -19.05,-1.27; 48 -19.05,1.27; 49 -21.59,-1.27; 50 -21.59,1.27; 51 -24.13,-1.27; 52 -24.13,1.27; 53 -26.67,-1.27; 54 -26.67,1.27; 55 -29.21,-1.27; 56 -29.21,1.27; 57 -31.75,-1.27; 58 -31.75,1.27; 59 -34.29,-1.27; 60 -34.29,1.27; 61 -36.83,-1.27; 62 -36.83,1.27; 63 -39.37,-1.27; 64 -39.37,1.27
CHIPLED_1206 = smd 1.5 x 1.5: A 0,-1.75; C 0,1.75
R0603 = smd 1 x 1.1: 1 -0.85,0; 2 0.85,0
0204/7 = drill 0.813 octagon: 1 -3.81,0; 2 3.81,0
P1-13 = drill 1.321 pad 2.159 octagon: TP 0,0
LAB-ASDM300F = drill 1: 1 5.397,9.207; 2 5.397,6.668; 3 5.397,4.128; 4 5.397,1.587; 5 13.018,1.587; 6 13.018,4.128; 7 13.018,6.668; 8 13.018,9.207
MSOP8 = smd 0.4 x 1.1: 1 -0.975,-2.25; 2 -0.325,-2.25; 3 0.325,-2.25; 4 0.975,-2.25; 5 0.975,2.25; 6 0.325,2.25; 7 -0.325,2.25; 8 -0.975,2.25
LAB-PPS330D = drill 1: 1 -3.81,3.81; 2 -3.81,1.27; 3 -3.81,-1.27; 4 -3.81,-3.81; 5 3.81,-3.81; 6 3.81,-1.27; 7 3.81,1.27; 8 3.81,3.81
SOT23-5 = smd 0.55 x 1.2: 1 -0.95,-1.3; 2 0,-1.3; 3 0.95,-1.3; 4 0.95,1.3; 5 -0.95,1.3
SO-08M = smd 0.6 x 2.2: 1 -1.905,-3.33; 2 -0.635,-3.33; 3 0.635,-3.33; 4 1.905,-3.33; 5 1.905,3.33; 6 0.635,3.33; 7 -0.635,3.33; 8 -1.905,3.33
MICROSD = smd 0.8 x 1.5: 1 -1.94,2.7; 2 -0.84,2.3; 3 0.26,2.7; 4 1.36,2.9; 5 2.46,2.7; 6 3.56,2.9; 7 4.66,2.7; 8 5.76,2.7 | smd 1.4 x 1.9: NC -6.85,6.55; NC3 6.55,5.55 | smd 1.8 x 1.4: NC1 -0.75,-7.6; NC2 4.95,-7.6
QFN10 = smd 0.711 x 0.305: 1 -0.953,0.75; 2 -0.953,0.25; 3 -0.953,-0.25; 4 -0.953,-0.75; 6 0.953,-0.75; 7 0.953,-0.25; 8 0.953,0.25; 9 0.953,0.75 | smd 0.305 x 0.711: 5 0,-0.953; 10 0,0.953
SOP65P640X90-16N = smd 1.422 x 0.229: 1 -2.845,2.286; 2 -2.845,1.626; 3 -2.845,0.965; 4 -2.845,0.33; 5 -2.845,-0.33; 6 -2.845,-0.965; 7 -2.845,-1.626; 8 -2.845,-2.286; 9 2.845,-2.286; 10 2.845,-1.626; 11 2.845,-0.965; 12 2.845,-0.33; 13 2.845,0.33; 14 2.845,0.965; 15 2.845,1.626; 16 2.845,2.286
LAB-PLR5010D = drill 1: !CLR -1.27,-3.81; !CS 1.27,-3.81; CHA -3.81,3.81; CHB 3.81,3.81; GND -3.81,-3.81; MCLK 3.81,-3.81; MOSI -1.27,3.81; VDD 1.27,3.81
ESP-12 = smd 2 x 1.2: 1 -7.5,4.5; 2 -7.5,2.5; 3 -7.5,0.5; 4 -7.5,-1.5; 5 -7.5,-3.5; 6 -7.5,-5.5; 7 -7.5,-7.5; 8 -7.5,-9.5; 9 7.5,-9.5; 10 7.5,-7.5; 11 7.5,-5.5; 12 7.5,-3.5; 13 7.5,-1.5; 14 7.5,0.5; 15 7.5,2.5; 16 7.5,4.5
SPBT2632C1A = smd 1.905 x 1.143: 1 -8.001,11.811; 2 -8.001,10.16; 3 -8.001,8.509; 4 -8.001,6.858; 5 -8.001,5.207; 6 -8.001,3.556; 7 -8.001,1.905; 8 -8.001,0.254; 9 -8.001,-1.397; 10 -8.001,-3.048; 11 -8.001,-4.699; 12 -8.001,-6.35; 13 8.001,-6.35; 14 8.001,-4.699; 15 8.001,-3.048; 16 8.001,-1.397; 17 8.001,0.254; 18 8.001,1.905; 19 8.001,3.556; 20 8.001,5.207; 21 8.001,6.858; 22 8.001,8.509; 23 8.001,10.16; 24 8.001,11.811
UM232H = drill 1: 3V3 -11.43,-7.62; 5V0 -13.97,7.62; !RST -8.89,7.62; AC0 16.51,7.62; AC1 13.97,7.62; AC2 11.43,7.62; AC3 8.89,7.62; AC4 6.35,7.62; AC5 3.81,7.62; AC6 1.27,7.62; AC7 -1.27,7.62; AC8 -3.81,7.62; AC9 -6.35,7.62; AD0 -1.27,-7.62; AD1 1.27,-7.62; AD2 3.81,-7.62; AD3 6.35,-7.62; AD4 8.89,-7.62; AD5 11.43,-7.62; AD6 13.97,-7.62; AD7 16.51,-7.62; GND-0 -16.51,7.62; GND-1 -3.81,-7.62; PU1 -6.35,-7.62; PU2 -8.89,-7.62; SLD -16.51,-7.62; USB -11.43,7.62; VIO -13.97,-7.62

### Placement (x,y rotation side)
C1  65.41,4.13 90 top
C2  70.17,48.9 180 top
C3  22.54,10.16 90 top
C4  82.71,109.38 90 top
C5  70.17,34.29 180 top
C6  26.35,62.23 0 top
C7  16.51,5.56 180 top
C8  70.17,19.68 180 top
C9  5.08,87 90 top
C10  40.64,87 90 top
C11  22.86,87 90 top
C12  75.56,117.16 0 top
C13  16.51,7.62 180 top
C14  71.12,88.27 90 top
C15  26.35,60.01 0 top
C16  63.18,4.13 90 top
C17  74.93,73.03 0 top
C18  74.93,65.41 0 top
C19  75.56,106.36 0 top
C20  55.88,88.27 90 top
C21  10.79,10.48 90 top
C22  11.75,4.37 270 top
J1  90.17,46.99 90 bottom
J2  140.97,46.99 90 bottom
LED1  13.65,3.57 180 top
R1  80.64,106.05 270 top
R2  80.64,102.71 270 top
R3  82.71,106.05 90 top
R4  9.53,4.37 270 top
R5  80.64,112.71 270 top
R6  82.71,112.71 90 top
R7  80.64,109.38 270 top
R8  77.47,73.98 270 top
R9  71.6,73.03 0 top
R10  27.94,94.61 270 top
R11  69.53,114.3 180 top
R12  69.53,116.36 0 top
R13  82.71,116.05 90 top
R14  80.64,116.05 270 top
R15  2.54,94.61 270 top
R16  10.16,94.61 270 top
R17  38.1,94.61 270 top
R18  20.32,94.61 270 top
R19  45.72,94.61 270 top
TP1  10.16,48.9 0 top
TP2  12.7,48.9 0 top
TP3  15.24,48.9 0 top
TP4  17.78,48.9 0 top
TP5  20.32,48.9 0 top
TP6  22.86,48.9 0 top
TP7  22.23,71.75 0 top
TP8  19.68,71.75 0 top
TP9  17.14,71.75 0 top
TP10  14.61,71.75 0 top
TP11  12.06,71.75 0 top
TP12  26.67,42.55 0 top
TP13  24.13,42.55 0 top
TP14  21.59,42.55 0 top
TP15  19.05,42.55 0 top
TP16  16.51,42.55 0 top
TP17  13.97,42.55 0 top
TP18  6.35,42.55 0 top
TP19  3.81,42.55 0 top
TP20  11.43,42.55 0 top
TP21  8.89,42.55 0 top
TP22  3.81,17.14 0 top
TP23  6.35,17.14 0 top
TP24  8.89,17.14 0 top
TP25  11.43,17.14 0 top
TP26  13.97,17.14 0 top
TP27  16.51,17.14 0 top
TP28  19.05,17.14 0 top
TP29  21.59,17.14 0 top
TP30  24.13,17.14 0 top
TP31  26.67,17.14 0 top
U1  75.25,78.74 90 top
U2  60.01,78.74 90 top
U3  75.56,103.82 270 top
U4  36.83,23.5 0 top
U5  54.61,52.7 0 top
U6  54.61,8.89 0 top
U7  75.56,109.38 270 top
U8  16.51,11.43 90 top
U9  71.12,52.7 270 top
U10  74.3,8.89 180 top
U11  71.12,38.1 270 top
U12  36.83,52.7 0 top
U13  36.83,38.1 0 top
U14  36.83,8.89 0 top
U15  16.51,3.17 180 top
U16  54.61,38.1 0 top
U17  71.12,23.5 270 top
U18  54.61,23.5 0 top
U19  71.12,69.22 0 top
U20  71.12,61.59 0 top
U21  75.56,114.62 270 top
U22  41.91,85.09 90 top
U23  6.35,85.09 90 top
U24  24.13,85.09 90 top
U25  13.97,60.96 90 top
U26  14.45,29.84 270 top
U27  115.57,92.71 270 top

### Tracks (layer width: path | path; a pad name or v marks a point on that pad's centre or on a via)
3V3  (via drill 0.3, 0.36, 1)
  Top 0.254: R4.2 v9.53,2.3 | U19.16 73.97,72.91 C17.1 | C17.1 73.98,73.03 | 73.92,72.87 C17.1 | 73.98,65.41 C18.1 73.97,65.29 U20.16 77.09,63.88 v78.74,62.23 | C17.1 R9.2 72.47,73.05 | 74.06,73.05 C17.1
  Top 0.406: v72.47,75.88 72.47,73.05 | R5.2 R7.1 80.55,110.33 v78.26,110.33 | U7.5 v78.26,110.33 | v78.26,110.33 | U22.VDD 40.42,86.36 C10.1 | U23.VDD 4.87,86.36 C9.1 | U24.VDD 22.64,86.36 C11.1
  other vias: 37.47,100.97 34.92,100.97 32.38,100.97 40.01,100.97
  pour Route15: 0,120.65 149.86,120.65 149.86,0 0,0 0,22.07 7.14,22.07 7.14,37.62 0,37.62 0,52.86 8.41,52.86 8.41,69.06 0,69.06
3V3_DISCO  (via drill 0.36)
  Top 0.406: J2.2 J2.1 v139.7,107.95 | 75.56,108.43 U7.4 80.55,108.43 R7.2 C4.1 | 75.56,108.43 U7.3 75.41,108.43 | U21.4 74.16,113.64 74.72,114.2 74.72,114.3 | 75.56,108.43 v75.56,107.95 | v75.56,107.95 75.56,113.45 74.72,114.3 | C12.1 74.72,114.3 | U3.4 74.27,102.85 74.61,103.19 74.61,106.26 C19.1 | C19.1 v73.03,106.36 | C19.1 74.72,107.1 v75.56,107.95
  Bottom 0.406: v139.7,107.95 v75.56,107.95
5V0  (via drill 0.3, 0.36, 1)
  Top 0.406: C20.1 U2.3 | C14.1 U1.3 | v50.16,100.97 v47.62,100.97 v45.09,100.97 v42.55,100.97 | v66.04,100.33 U1.8
  Top 0.813: U1.8 v66.04,86.36 | U2.8 v50.8,86.36
  Bottom 0.406: v50.16,100.97 50.8,100.33 v66.04,100.33
  Bottom 0.813: J1.2 J1.1 71.12,86.36 | 71.12,86.36 v66.04,86.36 55.88,86.36 | U1.3 71.12,86.36 | 55.88,86.36 U2.3 | v50.8,86.36 55.88,86.36
!BT_RESET  (via drill 0.3)
  Top 0.406: TP14.TP 22.95,41.18 U26.3 22.86,37.75 v22.86,31.75
  Bottom 0.406: v22.86,31.75 90.17,31.75 J1.44
!PLR0_CS  (via drill 0.3)
  Top 0.406: v104.14,25.4 v104.14,88.9
  Bottom 0.406: v104.14,25.4 J2.49 | v104.14,88.9 50.8,88.9 U22.!CLR
!PLR1_CS  (via drill 0.3, 0.36)
  Top 0.406: v118.75,24.13 v118.75,97.79 | v7.62,96.52 7.62,86.36 U23.!CLR
  Bottom 0.406: J2.52 140.97,24.13 v118.75,24.13 | v7.62,96.52 52.7,96.52 54.61,98.42 v118.75,97.79
!PLR2_CS  (via drill 0.3, 0.36)
  Top 0.406: v123.83,22.86 v123.83,72.39 | v78.74,72.39 v78.74,78.74 | v25.4,78.74 25.4,81.28 U24.!CLR
  Bottom 0.406: J2.51 v123.83,22.86 | v123.83,72.39 v78.74,72.39 | v78.74,78.74 v25.4,78.74
!PLR_CLR  (via drill 0.36)
  Top 0.406: v134.62,26.67 v134.62,90.17 | U22.!CS 43.18,83.82 v43.18,75.56 | U23.!CS 12.7,83.82 v12.7,75.56 | U24.!CS 24.13,82.55 v24.13,75.56
  Bottom 0.406: J2.50 140.97,26.67 v134.62,26.67 | v134.62,90.17 49.53,90.17 U22.!CS | v43.18,75.56 v24.13,75.56 v12.7,75.56
!PV_CLR  (via drill 0.3)
  Top 0.254: U19.15 76.56,70.84 v77.47,71.75 | U20.15 76.48,63.22 v78.74,60.96
  Top 0.406: R8.2 v77.47,71.75 | v85.09,60.96 v85.09,71.12
  Bottom 0.406: v77.47,71.75 78.11,71.12 v85.09,71.12 J1.13 | v78.74,60.96 v85.09,60.96
!PV_EN  (via drill 0.3)
  Top 0.254: 70.64,70.18 70.64,63.34 71.42,62.56 U20.14 75.87,62.56 v78.74,59.69 | 70.64,70.18 70.64,72.92 R9.1 | U19.14 70.64,70.18
  Top 0.406: v100.33,71.12 v100.33,59.69
  Bottom 0.406: J1.14 v100.33,71.12 | v100.33,59.69 v78.74,59.69
!USB_RST  (via drill 0.36)
  Top 0.406: U27.!RST 120.65,99.06 U27.PU1 | v133.35,52.07 v133.35,101.6
  Bottom 0.406: v133.35,101.6 U27.!RST | J2.30 140.97,52.07 v133.35,52.07
!WF_RESET  (via drill 0.3, 0.36)
  Top 0.406: 9.47,53.28 U25.1 9.53,53.52 v9.53,51.44 | v107.31,49.53 v107.31,73.66
  Bottom 0.406: v107.31,49.53 75.56,49.53 74.93,50.16 27.3,50.16 26.04,51.44 v9.53,51.44 | v107.31,73.66 J1.12
ADC1_PII1  (via drill 0.3, 0.36)
  Top 0.406: v95.25,87.63 v95.25,66.04 | U1.1 67.31,85.41 v67.31,87.63
  Bottom 0.406: v95.25,66.04 J2.17 | v95.25,87.63 v67.31,87.63
ADC1_PII2  (via drill 0.3)
  Top 0.406: v129.54,64.77 v129.54,85.09
  Bottom 0.406: v129.54,85.09 85.72,85.09 81.92,81.28 53.66,81.28 U2.1 | J2.20 140.97,64.77 v129.54,64.77
ADC2_PV0  (via drill 0.36)
  Top 0.406: R5.1 R6.2 82.81,113.67 v84.45,113.67 | v127,58.42 v127,113.67
  Bottom 0.406: J2.23 v127,58.42 | v127,113.67 v84.45,113.67
ADC2_PV1  (via drill 0.3, 0.36)
  Top 0.406: v125.73,57.15 v125.73,117.47 | U21.2 U21.1 73.31,117.45 v73.34,117.47
  Bottom 0.406: J2.26 140.97,57.15 v125.73,57.15 | v125.73,117.47 v73.34,117.47
ADC2_PV2  (via drill 0.36)
  Top 0.406: v128.27,55.88 v128.27,114.94 | U21.7 U21.6 v76.2,114.3
  Bottom 0.406: J2.25 v128.27,55.88 | v76.2,114.3 76.83,114.94 v128.27,114.94
ADC3_PIO0  (via drill 0.36)
  Top 0.406: 74.3,110.36 U7.1 74.3,110.36 73.16,110.36 v72.39,111.12 | J2.3 137.16,86.36 v137.16,111.12
  Bottom 0.406: v137.16,111.12 v72.39,111.12
ADC3_PIO1  (via drill 0.3, 0.36)
  Top 0.406: v135.89,72.39 v135.89,92.71
  Bottom 0.406: J2.13 138.43,72.39 v135.89,72.39 | v135.89,92.71 74.61,92.71 U1.5
ADC3_PIO2  (via drill 0.3, 0.36)
  Top 0.406: v130.81,69.85 v130.81,95.25 | U2.5 v58.42,95.89
  Bottom 0.406: J2.15 138.43,69.85 v130.81,69.85 | v130.81,95.25 106.68,95.25 106.05,95.89 v58.42,95.89
AF_CS  (via drill 0.36)
  Top 0.406: v64.77,8.89 64.77,24.13 66.04,25.4 U17.1
  Bottom 0.406: v64.77,8.89 140.97,8.89 J2.62
AF_VSEL0  (via drill 0.3)
  Top 0.254: U19.6 69.55,68.25 v69.53,68.26
  Top 0.406: U18.6 57.15,23.5 v57.15,68.26
  Bottom 0.254: v69.53,68.26 v57.15,68.26
AF_VSEL1  (via drill 0.3)
  Top 0.254: U20.6 v70.47,60.63 v70.48,60.64
  Top 0.406: v63.5,60.64 63.5,29.84 U18.7
  Bottom 0.254: v70.48,60.64 v63.5,60.64
BT_VSEL0  (via drill 0.3)
  Top 0.254: U19.12 77.46,68.89 v77.47,68.9
  Top 0.406: v38.1,69.85 38.1,39.37 U13.6
  Bottom 0.406: v38.1,69.85 76.52,69.85 v77.47,68.9
BT_VSEL1  (via drill 0.3)
  Top 0.254: U20.12 72.72,61.27 v72.39,61.59
  Top 0.406: v41.91,62.87 41.91,40.64 U13.7
  Bottom 0.254: v41.91,62.87 71.12,62.87 v72.39,61.59
DAC_OUT2  (via drill 0.3, 0.36)
  Top 0.406: v132.08,60.96 v132.08,100.33 | U3.5 77.81,100.36 v77.79,100.33
  Bottom 0.406: J2.21 v132.08,60.96 | v77.79,100.33 v132.08,100.33
EE_CS  (via drill 0.3, 0.36)
  Top 0.406: v107.31,10.16 v107.31,44.45 | v64.77,44.45 64.77,52.86 66.52,54.61 U9.1
  Bottom 0.406: J2.61 v107.31,10.16 | v107.31,44.45 v64.77,44.45
EE_VSEL0  (via drill 0.3)
  Top 0.254: U19.4 66.34,69.55 65.56,70.33 v65.56,71.36
  Top 0.406: U5.6 59.69,52.7 v59.69,71.36
  Bottom 0.406: v65.56,71.36 v59.69,71.36
EE_VSEL1  (via drill 0.3)
  Top 0.254: v64.77,55.24 64.77,60.33 66.37,61.92 U20.4
  Bottom 0.406: U5.7 63.5,53.98 v64.77,55.24
FMC_A0
  Bottom 0.406: J1.7 90.17,80.01 121.92,80.01 U27.AC1
FMC_D0  (via drill 0.3)
  Top 0.406: v117.47,13.97 117.47,84.45 U27.AD0
  Bottom 0.406: v117.47,13.97 140.97,13.97 J2.60
FMC_D1  (via drill 0.3)
  Top 0.406: v116.2,12.7 116.2,83.19 U27.AD1
  Bottom 0.406: v116.2,12.7 J2.59
FMC_D2  (via drill 0.3)
  Top 0.406: v114.94,35.56 114.94,81.92 U27.AD2
  Bottom 0.406: J1.42 v114.94,35.56
FMC_D3  (via drill 0.36)
  Top 0.406: U27.AD3 113.67,80.64 v113.67,34.29
  Bottom 0.406: v113.67,34.29 90.17,34.29 J1.41
FMC_D4  (via drill 0.3)
  Top 0.406: U27.AD4 112.39,79.38 v112.39,43.18
  Bottom 0.406: v112.39,43.18 137.16,43.18 J2.37
FMC_D5  (via drill 0.3)
  Top 0.406: U27.AD5 111.12,78.11 v111.12,39.37
  Bottom 0.406: v111.12,39.37 140.97,39.37 J2.40
FMC_D6  (via drill 0.3)
  Top 0.406: U27.AD6 109.86,76.83 v109.86,38.1
  Bottom 0.406: v109.86,38.1 J2.39
FMC_D7  (via drill 0.3)
  Top 0.406: v108.58,36.83 108.58,74.3 107.95,74.93 U27.AD7
  Bottom 0.406: v108.58,36.83 140.97,36.83 J2.42
FMC_NE2  (via drill 0.3)
  Top 0.406: v122.56,46.99 122.56,74.3 123.19,74.93 U27.AC0
  Bottom 0.406: v122.56,46.99 90.17,46.99 J1.33
FMC_NOE  (via drill 0.3)
  Top 0.406: U27.AC2 121.28,79.38 v121.28,40.64
  Bottom 0.406: v121.28,40.64 J1.38
FMC_NWE  (via drill 0.3)
  Top 0.406: U27.AC3 120.02,80.64 v120.02,41.91
  Bottom 0.406: v120.02,41.91 90.17,41.91 J1.37
GND  (via drill 0.3, 0.36, 1)
  Top 0.254: C22.2 v11.75,2.3 | C17.2 75.78,73.13 | C17.2 75.78,73.14 | U20.8 68.28,58.77 v68.58,58.46 | C18.2 76.68,65.41 v78.74,63.34 | U19.8 69.15,66.93 v69.69,67.47 69.63,67.41 | 75.88,73.13 C17.2 | 77.25,74.61 R8.1 v77.47,76.04 | 77.15,74.61 75.78,73.24 C17.2
  Top 0.406: U10.6 70.73,4.06 v70.48,3.81 | R14.1 80.64,117.16 C12.2 76.2,116.94 v76.2,115.41 76.22,115.59 U21.8 | 68.68,116.15 R12.1 68.74,116.42 v68.74,117.95 | R6.1 C4.2 82.77,110.28 82.77,110.33 83.98,110.33 v84.3,110.01 | v63.18,6.35 C16.2 C1.2 | C14.2 U1.6 | C20.2 U2.6 | U7.2 73.34,109.38 v72.39,108.43 | C19.2 v77.79,106.36 | R1.1 78.32,106.89 v77.79,106.36 | U3.8 77.81,106.33 v77.79,106.36 | C9.2 v5.08,88.9 | C11.2 v22.86,88.9 | C10.2 v40.64,88.9 | 77.25,74.61 77.15,74.61
  other vias: 47.62,118.75 45.09,118.75 42.55,118.75 40.01,118.75 37.47,118.75 34.92,118.75 32.38,118.75 29.84,118.75 27.3,118.75 24.77,118.75 22.23,118.75 19.68,118.75 17.14,118.75 14.61,118.75 12.06,118.75 9.53,118.75 1.91,100.97 4.45,100.97 6.99,100.97 9.53,100.97 9.53,116.2 9.53,113.67 9.53,111.12 6.99,111.12 4.45,111.12 1.91,111.12 1.91,108.58 1.91,106.05 1.91,103.5
  pour Route2: 0,120.65 149.86,120.65 149.86,0 0,0 0,22.07 7.14,22.07 7.14,37.62 0,37.62 0,52.86 8.41,52.86 8.41,69.06 0,69.06
I2C3_SCL  (via drill 0.36, 1)
  Top 0.254: U15.2 18.16,2.92 v27.3,12.06
  Top 0.406: U8.3 v27.3,12.06 | v99.06,11.43 v99.06,19.05 v99.06,116.2
  Bottom 0.406: v99.06,11.43 27.94,11.43 v27.3,12.06 | J1.53 90.17,19.05 v99.06,19.05 | v50.16,116.2 v99.06,116.2
I2C3_SDA  (via drill 0.36, 1)
  Top 0.254: U15.1 18.62,2.42 v29.53,13.34
  Top 0.406: U8.4 v29.53,13.34 | v97.79,118.75 v97.79,20.32 v97.79,13.97
  Bottom 0.406: v97.79,13.97 30.16,13.97 v29.53,13.34 | J1.54 v97.79,20.32 | v50.16,118.75 v97.79,118.75
LD3  (via drill 0.36, 1)
  Top 0.406: v86.36,109.22 86.36,52.07 87.63,50.8 J1.29
  Bottom 0.406: v50.16,111.12 52.07,109.22 v86.36,109.22
LD4  (via drill 0.36, 1)
  Top 0.406: J1.30 93.98,53.34 v93.98,112.39
  Bottom 0.406: v93.98,112.39 51.44,112.39 v50.16,113.67
N$1  (via drill 0.3)
  Top 0.406: C6.1 C15.1 v23.5,60.01 23.47,59.98 U25.8
  Bottom 0.406: U12.8 37.15,60.01 v23.5,60.01
N$2  (via drill 0.3)
  Top 0.406: C2.2 v67.94,48.9 67.94,50.65 U9.4
  Bottom 0.406: U5.5 v67.94,48.9
N$3
  Top 0.254: R4.1 9.53,5.32 | 11.64,5.32 C22.1 | 11.85,5.32 C22.1 | 11.85,5.32 C22.1
  Top 0.406: 9.53,5.32 11.64,5.32 | LED1.A 11.85,5.32
N$4
  Top 0.406: TP12.TP 26.26,42.13 U26.1
N$5  (via drill 0.3)
  Top 0.406: U13.5 36.83,30.48 v36.83,26.04 | v24.77,26.04 24.77,22 U26.23
  Bottom 0.406: v24.77,26.04 v36.83,26.04
N$6
  Top 0.406: TP10.TP 15.47,70.89 U25.13
N$7
  Top 0.406: TP7.TP 21.47,71 U25.10
N$8
  Top 0.406: TP13.TP 24.61,42.07 U26.2
N$9
  Top 0.406: TP8.TP 19.47,71.54 U25.11
N$10
  Top 0.406: TP9.TP 17.47,71.43 U25.12
N$11
  Top 0.406: TP11.TP 13.47,70.35 U25.14
N$12
  Top 0.406: TP1.TP 11.47,50.2 U25.2
N$13
  Top 0.406: TP2.TP 13.47,49.66 U25.3
N$14
  Top 0.406: TP3.TP 15.47,49.12 U25.4
N$15
  Top 0.406: TP4.TP 17.47,49.2 U25.5
N$16
  Top 0.406: TP5.TP 19.47,49.74 U25.6
N$17
  Top 0.406: TP6.TP 21.47,50.28 U25.7
N$18
  Top 0.406: TP15.TP 21.3,40.29 U26.4
N$19
  Top 0.406: TP16.TP 19.65,39.4 U26.5
N$20
  Top 0.254: U15.9 14.26,2.42 LED1.C
N$21
  Top 0.406: TP17.TP 16.35,40.16 U26.7
N$22  (via drill 0.3)
  Top 0.406: 23.59,68.58 U25.9 27.2,64.73 C6.2 C15.2 27.3,59.91 v27.3,47.62
  Bottom 0.406: U12.5 39.37,47.62 v27.3,47.62
N$23
  Top 0.406: TP18.TP 9.75,39.15 U26.11
N$24  (via drill 0.3)
  Top 0.406: C5.2 v67.94,34.29 67.94,36.04 U11.4
  Bottom 0.406: v67.94,34.29 U16.5
N$25
  Top 0.406: U27.USB 120.65,101.6 U27.PU2
N$26  (via drill 0.3)
  Top 0.406: v26.04,35.56 26.04,22.1 26.04,22.07 U26.24
  Bottom 0.406: U13.8 34.29,35.56 v26.04,35.56
N$27
  Top 0.406: U8.1 22.33,9.53 C3.1
N$28
  Top 0.406: TP19.TP 8.1,38.26 U26.12
N$29
  Top 0.406: TP22.TP 8.1,21.43 U26.13
N$30
  Top 0.406: TP23.TP 9.75,20.54 U26.14
N$31  (via drill 0.3)
  Top 0.406: U17.4 67.94,21.59 v67.94,19.68 C8.2
  Bottom 0.406: U18.5 v67.94,19.68
N$32
  Top 0.406: TP24.TP 11.4,19.65 U26.15
N$33
  Top 0.406: TP25.TP 13.05,18.76 U26.16
N$34
  Top 0.406: TP26.TP 14.7,17.88 U26.17
N$35
  Top 0.406: TP27.TP 16.35,17.3 U26.18
N$36
  Top 0.406: TP28.TP 18,18.19 U26.19
N$37
  Top 0.406: TP29.TP 19.65,19.08 U26.20
N$38  (via drill 0.3)
  Top 0.254: C7.2 15.66,5.18 | U15.8 15.01,2.92 14.76,3.17 14.76,4.66 C7.2 | C7.2 15.66,6.57
  Top 0.406: C7.2 C13.2 v14.29,7.62
  Bottom 0.254: U14.5 39.37,3.81
  Bottom 0.406: 39.37,3.81 18.1,3.81 v14.29,7.62
N$39  (via drill 0.3)
  Top 0.254: 10.69,11.43 C21.2
  Top 0.406: 22.54,10.79 C3.2 22.33,10.79 U8.2 17.14,10.79 v16.51,11.43 | v8.89,11.43 10.69,11.43
  Bottom 0.406: v8.89,11.43 v16.51,11.43 20.32,15.24 27.62,15.24 30.16,17.78 38.73,17.78 U4.5
N$40  (via drill 0.3, 0.36)
  Top 0.254: U15.3 17.95,3.42 18.34,3.81 18.34,4.58 C7.1
  Top 0.406: C13.1 17.36,6.35 | 17.36,6.35 C7.1 | v19.05,6.35 17.36,6.35 | U14.8 38.1,10.16 38.1,7.62 v36.83,6.35
  Bottom 0.406: v36.83,6.35 v19.05,6.35
N$41
  Top 0.406: TP30.TP 21.3,19.97 U26.21
N$42
  Top 0.406: TP31.TP 22.86,20.95 22.86,21.59 22.95,21.68 U26.22
N$51
  Top 0.406: TP20.TP 13.05,40.93 U26.9
N$52
  Top 0.406: TP21.TP 11.4,40.04 U26.10
N$54  (via drill 1)
  other vias: 12.06,116.2
N$55  (via drill 1)
  other vias: 14.61,116.2
N$58  (via drill 1)
  other vias: 4.45,108.58
N$59  (via drill 1)
  other vias: 4.45,106.05
N$62  (via drill 1)
  other vias: 12.06,113.67
N$64  (via drill 1)
  other vias: 6.99,108.58
N$65  (via drill 1)
  other vias: 17.14,116.2
N$66  (via drill 1)
  other vias: 19.68,116.2
N$67  (via drill 1)
  other vias: 22.23,116.2
N$68  (via drill 1)
  other vias: 24.77,116.2
N$69  (via drill 1)
  other vias: 24.77,113.67
N$70  (via drill 1)
  other vias: 22.23,113.67
N$71  (via drill 1)
  other vias: 19.68,113.67
N$72  (via drill 1)
  other vias: 17.14,113.67
N$73  (via drill 1)
  other vias: 14.61,113.67
N$74  (via drill 1)
  other vias: 12.06,111.12
N$75  (via drill 1)
  other vias: 14.61,111.12
N$77  (via drill 1)
  other vias: 17.14,111.12
N$78  (via drill 1)
  other vias: 19.68,111.12
N$79  (via drill 1)
  other vias: 22.23,111.12
N$80  (via drill 1)
  other vias: 24.77,111.12
N$81  (via drill 1)
  other vias: 24.77,108.58
N$82  (via drill 1)
  other vias: 9.53,108.58
N$83  (via drill 1)
  other vias: 12.06,108.58
N$84  (via drill 1)
  other vias: 14.61,108.58
N$85  (via drill 1)
  other vias: 17.14,108.58
N$86  (via drill 1)
  other vias: 19.68,108.58
N$87  (via drill 1)
  other vias: 22.23,108.58
N$88  (via drill 1)
  other vias: 6.99,106.05
N$90  (via drill 1)
  other vias: 9.53,106.05
N$92  (via drill 1)
  other vias: 12.06,106.05
N$93  (via drill 1)
  other vias: 14.61,106.05
N$94  (via drill 1)
  other vias: 17.14,106.05
N$95  (via drill 1)
  other vias: 19.68,106.05
N$97  (via drill 1)
  other vias: 22.23,106.05
N$98  (via drill 1)
  other vias: 24.77,106.05
N$99  (via drill 1)
  other vias: 27.3,116.2
N$100  (via drill 1)
  other vias: 27.3,113.67
N$101  (via drill 1)
  other vias: 27.3,111.12
N$102  (via drill 1)
  other vias: 27.3,108.58
N$103  (via drill 1)
  other vias: 27.3,106.05
N$104  (via drill 1)
  other vias: 29.84,106.05
N$105  (via drill 1)
  other vias: 29.84,108.58
N$106  (via drill 1)
  other vias: 29.84,111.12
N$107  (via drill 1)
  other vias: 29.84,113.67
N$108  (via drill 1)
  other vias: 29.84,116.2
N$109  (via drill 1)
  other vias: 32.38,116.2
N$110  (via drill 1)
  other vias: 32.38,113.67
N$111  (via drill 1)
  other vias: 32.38,111.12
N$112  (via drill 1)
  other vias: 32.38,108.58
N$113  (via drill 1)
  other vias: 32.38,106.05
N$114  (via drill 1)
  other vias: 34.92,106.05
N$115  (via drill 1)
  other vias: 34.92,108.58
N$116  (via drill 1)
  other vias: 34.92,111.12
N$117  (via drill 1)
  other vias: 34.92,113.67
N$118  (via drill 1)
  other vias: 34.92,116.2
N$119  (via drill 1)
  other vias: 37.47,116.2
N$120  (via drill 1)
  other vias: 37.47,113.67
N$121  (via drill 1)
  other vias: 37.47,111.12
N$122  (via drill 1)
  other vias: 37.47,108.58
N$123  (via drill 1)
  other vias: 37.47,106.05
N$124  (via drill 1)
  other vias: 40.01,106.05
N$125  (via drill 1)
  other vias: 40.01,108.58
N$126  (via drill 1)
  other vias: 40.01,111.12
N$127  (via drill 1)
  other vias: 40.01,113.67
N$128  (via drill 1)
  other vias: 40.01,116.2
N$129  (via drill 1)
  other vias: 42.55,106.05
N$130  (via drill 1)
  other vias: 42.55,108.58
N$131  (via drill 1)
  other vias: 42.55,111.12
N$132  (via drill 1)
  other vias: 42.55,113.67
N$133  (via drill 1)
  other vias: 42.55,116.2
N$134  (via drill 1)
  other vias: 45.09,116.2
N$135  (via drill 1)
  other vias: 45.09,113.67
N$136  (via drill 1)
  other vias: 45.09,111.12
N$137  (via drill 1)
  other vias: 45.09,108.58
N$138  (via drill 1)
  other vias: 45.09,106.05
N$139  (via drill 1)
  other vias: 47.62,106.05
N$140  (via drill 1)
  other vias: 47.62,108.58
N$141  (via drill 1)
  other vias: 47.62,111.12
N$142  (via drill 1)
  other vias: 47.62,113.67
N$143  (via drill 1)
  other vias: 47.62,116.2
N$155  (via drill 1)
  other vias: 4.45,103.5
N$157  (via drill 1)
  other vias: 6.99,103.5
N$158  (via drill 1)
  other vias: 9.53,103.5
N$159  (via drill 1)
  other vias: 12.06,103.5
N$160  (via drill 1)
  other vias: 14.61,103.5
N$161  (via drill 1)
  other vias: 17.14,103.5
N$162  (via drill 1)
  other vias: 19.68,103.5
N$163  (via drill 1)
  other vias: 22.23,103.5
N$164  (via drill 1)
  other vias: 24.77,103.5
N$165  (via drill 1)
  other vias: 27.3,103.5
N$166  (via drill 1)
  other vias: 29.84,103.5
N$167  (via drill 1)
  other vias: 32.38,103.5
N$168  (via drill 1)
  other vias: 34.92,103.5
N$169  (via drill 1)
  other vias: 37.47,103.5
N$170  (via drill 1)
  other vias: 40.01,103.5
N$171  (via drill 1)
  other vias: 42.55,103.5
N$172  (via drill 1)
  other vias: 45.09,103.5
N$174  (via drill 1)
  other vias: 47.62,103.5
N$176
  Top 1.219: U22.CHB R17.2
N$177
  Top 1.219: U22.MCLK R19.2
N$178
  Top 1.219: U23.MCLK R16.2
N$179
  Top 1.219: U23.CHB R15.2
N$180
  Top 1.219: U24.MCLK R10.2
N$181
  Top 1.219: U24.CHB R18.2
N$182
  Top 0.406: R13.1 R14.2 80.27,115.2 78.72,113.64 U21.5
N$183
  Top 0.406: R12.2 R11.1 U21.3
OF_CS  (via drill 0.36)
  Top 0.406: v66.04,40.01 U11.1
  Bottom 0.406: J1.35 86.36,40.64 66.67,40.64 v66.04,40.01
OF_VSEL0  (via drill 0.3)
  Top 0.254: U19.5 69.84,68.89 v69.93,68.98
  Top 0.406: U16.6 60.96,39.37 v60.96,68.9
  Bottom 0.254: v69.93,68.98 69.85,68.9 v60.96,68.9
OF_VSEL1  (via drill 0.3)
  Top 0.254: U20.5 69.52,61.27 v69.53,61.28
  Top 0.406: v62.23,40.64 v62.23,61.28
  Bottom 0.254: v69.53,61.28 v62.23,61.28
  Bottom 0.406: U16.7 60.96,39.37 v62.23,40.64
PS_VSEL0  (via drill 0.3)
  Top 0.254: U19.9 73.25,66.93 v72.23,66.04
  Top 0.406: U14.6 46.99,13.97 v46.99,66.04
  Bottom 0.254: v46.99,66.04 v72.23,66.04
PS_VSEL1  (via drill 0.3)
  Top 0.254: U20.9 75.55,59.31 v75.56,59.29
  Top 0.406: U14.7 45.72,15.24 v45.72,59.29
  Bottom 0.254: v75.56,59.29 v45.72,59.29
PV1  (via drill 1)
  Top 0.406: U1.7 68.58,114.2 R11.2
  Top 0.61: v12.06,100.97 v14.61,100.97 v17.14,100.97 v19.68,100.97
  Top 1.219: U14.2 31.11,10.16 v31.11,16.19 31.11,24.77 | U4.2 31.11,24.77 | 31.11,24.77 31.11,39.37 | 31.11,39.37 31.11,53.98 | U13.2 31.11,39.37 | U6.2 48.9,10.16 v48.9,16.19 48.9,24.77 | 48.9,24.77 48.9,39.37 | 48.9,39.37 48.9,53.98 U5.2 | U16.2 48.9,39.37 | U18.2 48.9,24.77 | U12.2 31.11,53.98 | 31.11,53.98 v31.11,94.61 13.97,94.61 R16.1 | R16.1 R15.1 | v12.06,100.97 12.06,100.33 R16.1
  Bottom 1.219: v48.9,16.19 v31.11,16.19 | v31.11,94.61 65.72,94.61 U1.7
PV2  (via drill 0.36, 1)
  Top 0.406: 82.77,116.84 R13.2 82.61,116.9 82.55,116.84 87,116.84 89.53,114.3 v89.53,97.16 | v55.88,97.16 53.34,94.61
  Top 0.61: v22.23,100.97 v24.77,100.97 26.04,100.97 | 26.04,100.97 v27.3,100.97 v29.84,100.97 | 26.04,98.42 26.04,100.97
  Top 1.219: U14.1 34.92,12.7 34.92,27.3 | 34.92,27.3 34.92,41.91 | 34.92,41.91 v34.92,45.4 34.92,56.52 | U13.1 34.92,41.91 | U4.1 34.92,27.3 | U6.1 52.7,12.7 52.7,27.3 | 52.7,27.3 52.7,41.91 | 52.7,41.91 v52.7,45.4 52.7,56.52 U5.1 | U16.1 52.7,41.91 | U18.1 52.7,27.3 | U12.1 34.92,56.52 | 34.92,56.52 34.92,94.61 | U2.7 53.34,94.61 34.92,94.61 | R18.1 26.04,98.42 R10.1 31.11,98.42 34.92,94.61
  Bottom 0.406: v89.53,97.16 v55.88,97.16
  Bottom 1.219: v34.92,45.4 v52.7,45.4
PV_D0  (via drill 0.3)
  Top 0.254: v80.01,76.2 80.01,72.39 77.17,69.55 U19.13
  Bottom 0.406: v80.01,76.2 J1.9
PV_D1  (via drill 0.3)
  Top 0.254: v78.74,57.15 78.74,58.42 75.23,61.92 U20.13
  Top 0.406: v101.6,76.2 v101.6,57.15
  Bottom 0.406: J1.10 v101.6,76.2 | v101.6,57.15 v78.74,57.15
PV_VSEL0  (via drill 0.3)
  Top 0.254: v64.77,72.07 64.77,66.04 66.93,63.88 U20.1 | v68.26,72.07 68.26,71.51 U19.1
  Bottom 0.406: v64.77,72.07 v68.26,72.07 75.56,72.07 79.06,68.58 J1.15
PV_VSEL1  (via drill 0.36)
  Top 0.254: v64.14,74.93 64.14,65.72 66.64,63.22 U20.2 | U19.2 69.09,70.84 69.69,71.44 v69.69,74.93
  Top 0.406: v96.52,68.58 v96.52,74.93
  Bottom 0.406: J1.16 v96.52,68.58 | v96.52,74.93 v69.69,74.93 v64.14,74.93
PV_VSEL2  (via drill 0.3)
  Top 0.254: v63.5,73.66 63.5,65.41 66.34,62.56 U20.3 | v66.36,73.66 66.36,70.8 66.98,70.18 U19.3
  Bottom 0.406: v63.5,73.66 v66.36,73.66 84.45,73.66 J1.11
SD_CS
  Top 0.406: U10.2 75.14,7.19 85.72,17.78 J1.55
SD_VSEL0  (via drill 0.3)
  Top 0.254: U19.7 67.03,67.59 v66.99,67.63
  Top 0.406: U6.6 54.61,11.43 v54.61,67.63
  Bottom 0.254: v54.61,67.63 v66.99,67.63
SD_VSEL1  (via drill 0.3)
  Top 0.254: U20.7 66.08,59.97 v66.04,60.01
  Top 0.406: U6.7 55.88,12.7 v55.88,60.01
  Bottom 0.254: v66.04,60.01 v55.88,60.01
SPI5_MCLK  (via drill 0.3, 0.36, 1)
  Top 0.406: U10.5 71.83,7.7 82.55,18.41 v82.55,22.86 v82.55,37.47 v82.55,52.07 v82.55,80.01 | U9.6 v77.15,52.07 | v77.47,37.47 U11.6 | U17.6 v77.47,22.86 | v62.23,101.6 v62.23,80.01
  Bottom 0.406: v77.47,37.47 v82.55,37.47 | J2.6 140.97,82.55 85.09,82.55 v82.55,80.01 v62.23,80.01 45.72,80.01 | v77.15,52.07 v82.55,52.07 | v77.47,22.86 v82.55,22.86 | U22.GND 45.72,80.01 | 45.72,80.01 27.94,80.01 | 27.94,80.01 11.43,80.01 U23.GND | U24.GND 27.94,80.01 | v50.16,103.5 52.07,101.6 v62.23,101.6
SPI5_MISO  (via drill 0.3, 0.36, 1)
  Top 0.406: U10.7 69.64,7.41 81.28,19.05 v81.28,24.13 v81.28,38.73 v81.28,53.34 v81.28,62.23 v81.28,99.06 | U9.2 v69.85,53.34 | v137.16,62.23 137.16,78.74 J2.5 | U11.2 v69.85,38.73 | U17.2 v69.85,24.13
  Bottom 0.406: v69.85,38.73 v81.28,38.73 | v69.85,24.13 v81.28,24.13 | v81.28,53.34 v69.85,53.34 | v137.16,62.23 v81.28,62.23 | v50.16,108.58 54.61,104.14 64.14,104.14 69.22,99.06 v81.28,99.06
SPI5_MOSI  (via drill 0.3, 0.36, 1)
  Top 0.406: U9.5 v76.52,50.8 | U10.3 74.03,8 83.82,17.78 v83.82,21.59 v83.82,36.2 v83.82,50.8 v83.82,77.47 | U11.5 v76.83,36.2 | U17.5 v76.83,21.59 | U24.MOSI 22.86,81.28 v22.86,77.47 | U22.MOSI 40.64,81.28 v40.64,77.47 | U23.MOSI 5.08,81.28 v5.08,77.47 | v59.69,102.87 v59.69,77.47
  Bottom 0.406: v76.83,36.2 v83.82,36.2 | v76.52,50.8 v83.82,50.8 | v76.83,21.59 v83.82,21.59 | J2.8 140.97,77.47 v83.82,77.47 v59.69,77.47 v40.64,77.47 v22.86,77.47 v5.08,77.47 | v50.16,106.05 53.34,102.87 v59.69,102.87
TH_VSEL0  (via drill 0.3, 0.36)
  Top 0.254: U19.10 72.59,67.59 71.44,66.52 v71.44,63.5
  Top 0.406: U4.6 44.45,26.04 v44.45,63.5
  Bottom 0.406: v71.44,63.5 v44.45,63.5
TH_VSEL1  (via drill 0.3)
  Top 0.254: U20.10 72.59,59.97 v70.33,62.23
  Top 0.406: U4.7 43.18,27.3 v43.18,62.23
  Bottom 0.254: v43.18,62.23 v70.33,62.23
UART5_RX  (via drill 0.3)
  Top 0.406: v17.78,29.21 17.78,37.62 U26.6 | v96.52,38.1 v96.52,29.21
  Bottom 0.406: J1.40 v96.52,38.1 | v96.52,29.21 v17.78,29.21
UART5_TX  (via drill 0.3)
  Top 0.406: 14.86,37.72 14.61,37.47 | 14.61,37.47 v14.61,33.02 | U26.8 14.7,37.56 14.61,37.47
  Bottom 0.406: J1.43 v14.61,33.02
USART1_RX  (via drill 0.3, 0.36)
  Top 0.406: v29.21,30.48 v29.21,66.04 | v9.53,66.04 9.53,68.41 U25.16 | J1.51 86.36,25.4 v86.36,30.48
  Bottom 0.406: v86.36,30.48 v29.21,30.48 | v29.21,66.04 v9.53,66.04
USART1_TX  (via drill 0.3)
  Top 0.406: v95.25,64.77 95.25,26.67 J1.52 | v11.43,64.77 11.43,68.42 U25.15
  Bottom 0.406: v95.25,64.77 v11.43,64.77
VADJ1
  Top 0.406: U1.2 69.85,85.41 69.85,102.55 72.09,104.8 U3.1 U3.2
VADJ1_0  (via drill 0.36)
  Top 0.406: v102.87,54.61 v102.87,106.68 | v84.45,106.68 82.92,106.68 R3.2
  Bottom 0.406: J1.25 90.17,54.61 v102.87,54.61 | v102.87,106.68 v84.45,106.68
VADJ1_1  (via drill 0.3, 0.36)
  Top 0.406: v105.41,58.42 v105.41,101.76 | R2.2 80.75,101.76 v82.39,101.76
  Bottom 0.406: J1.24 v105.41,58.42 | v105.41,101.76 v82.39,101.76
VADJ2  (via drill 0.3)
  Top 0.406: U3.7 U3.6 76.83,103.5 76.2,102.87 v76.2,82.55
  Bottom 0.406: v76.2,82.55 54.93,82.55 U2.2
VADJIN  (via drill 0.36)
  Top 0.406: R3.1 R1.2 R2.1 80.7,103.5 v82.39,103.5 | v72.23,103.5 v72.24,103.5 U3.3
  Bottom 0.406: v82.39,103.5 v72.23,103.5
VAF  (via drill 0.3)
  Top 0.406: 68.02,22.86 U17.3 71.12,22.86 | 71.12,24.13 U17.7 | C8.1 71.12,19.68 71.12,22.86 | 71.12,22.86 71.12,24.13 | 71.12,24.13 71.12,25.4 | 71.12,25.4 v71.12,27.3 | U17.8 71.12,25.4
  Bottom 0.406: U18.8 v71.12,27.3
VEE  (via drill 0.3)
  Top 0.254: 74.3,54.77 U9.8
  Top 0.406: 71.12,52.07 71.12,49 C2.1 | U9.3 71.12,52.07 | U9.8 U9.7 72.39,53.34 71.12,52.07 | v74.3,56.52 74.3,54.77
  Bottom 0.406: U5.8 v74.3,56.52
VOF  (via drill 0.3)
  Top 0.406: 71.12,37.47 71.12,34.39 C5.1 | 72.39,38.73 U11.7 71.12,38.73 | U11.3 71.12,37.47 | 71.12,37.47 71.12,38.73 | 71.12,38.73 71.12,40.01 | 71.12,40.01 v71.12,41.91 | U11.8 71.12,40.01
  Bottom 0.406: U16.8 v71.12,41.91
VSD
  Top 0.254: U10.4 72.94,4.36 70.48,1.91 66.67,1.91 65.41,3.17 C1.1 | C16.1 62.76,3.28 59.69,6.35 59.69,11.43 U6.8
  Top 0.406: C16.1 C1.1
VTH  (via drill 0.3)
  Top 0.406: C21.1 10.9,9.53 U8.8 v16.51,9.53 | v36.83,8.89 36.83,23.5 U4.8
  Bottom 0.406: v16.51,9.53 17.14,8.89 v36.83,8.89
WF_VSEL0  (via drill 0.3)
  Top 0.254: U19.11 78.12,68.25 v78.74,67.63
  Top 0.406: U12.6 39.37,52.7 v39.37,66.67
  Bottom 0.254: v39.37,66.67 77.79,66.67 v78.74,67.63
WF_VSEL1  (via drill 0.3)
  Top 0.254: v76.52,57.78 76.52,59.69 75.58,60.63 U20.11
  Bottom 0.406: U12.7 44.45,57.78 v76.52,57.78

### Text on the board
tNames: I2C3_SDA | I2C3_SCL | LD4 | LD3 | SPI5_MISO | SPI5_MOSI | SPI5_MCLK | GND | PV1 | PV2 | 3V3 | 5V0 | LAB-DEB429A-REV1